# Altium project Time4CM4_PCIeCarrier.PrjPcb (part 1 of 2)
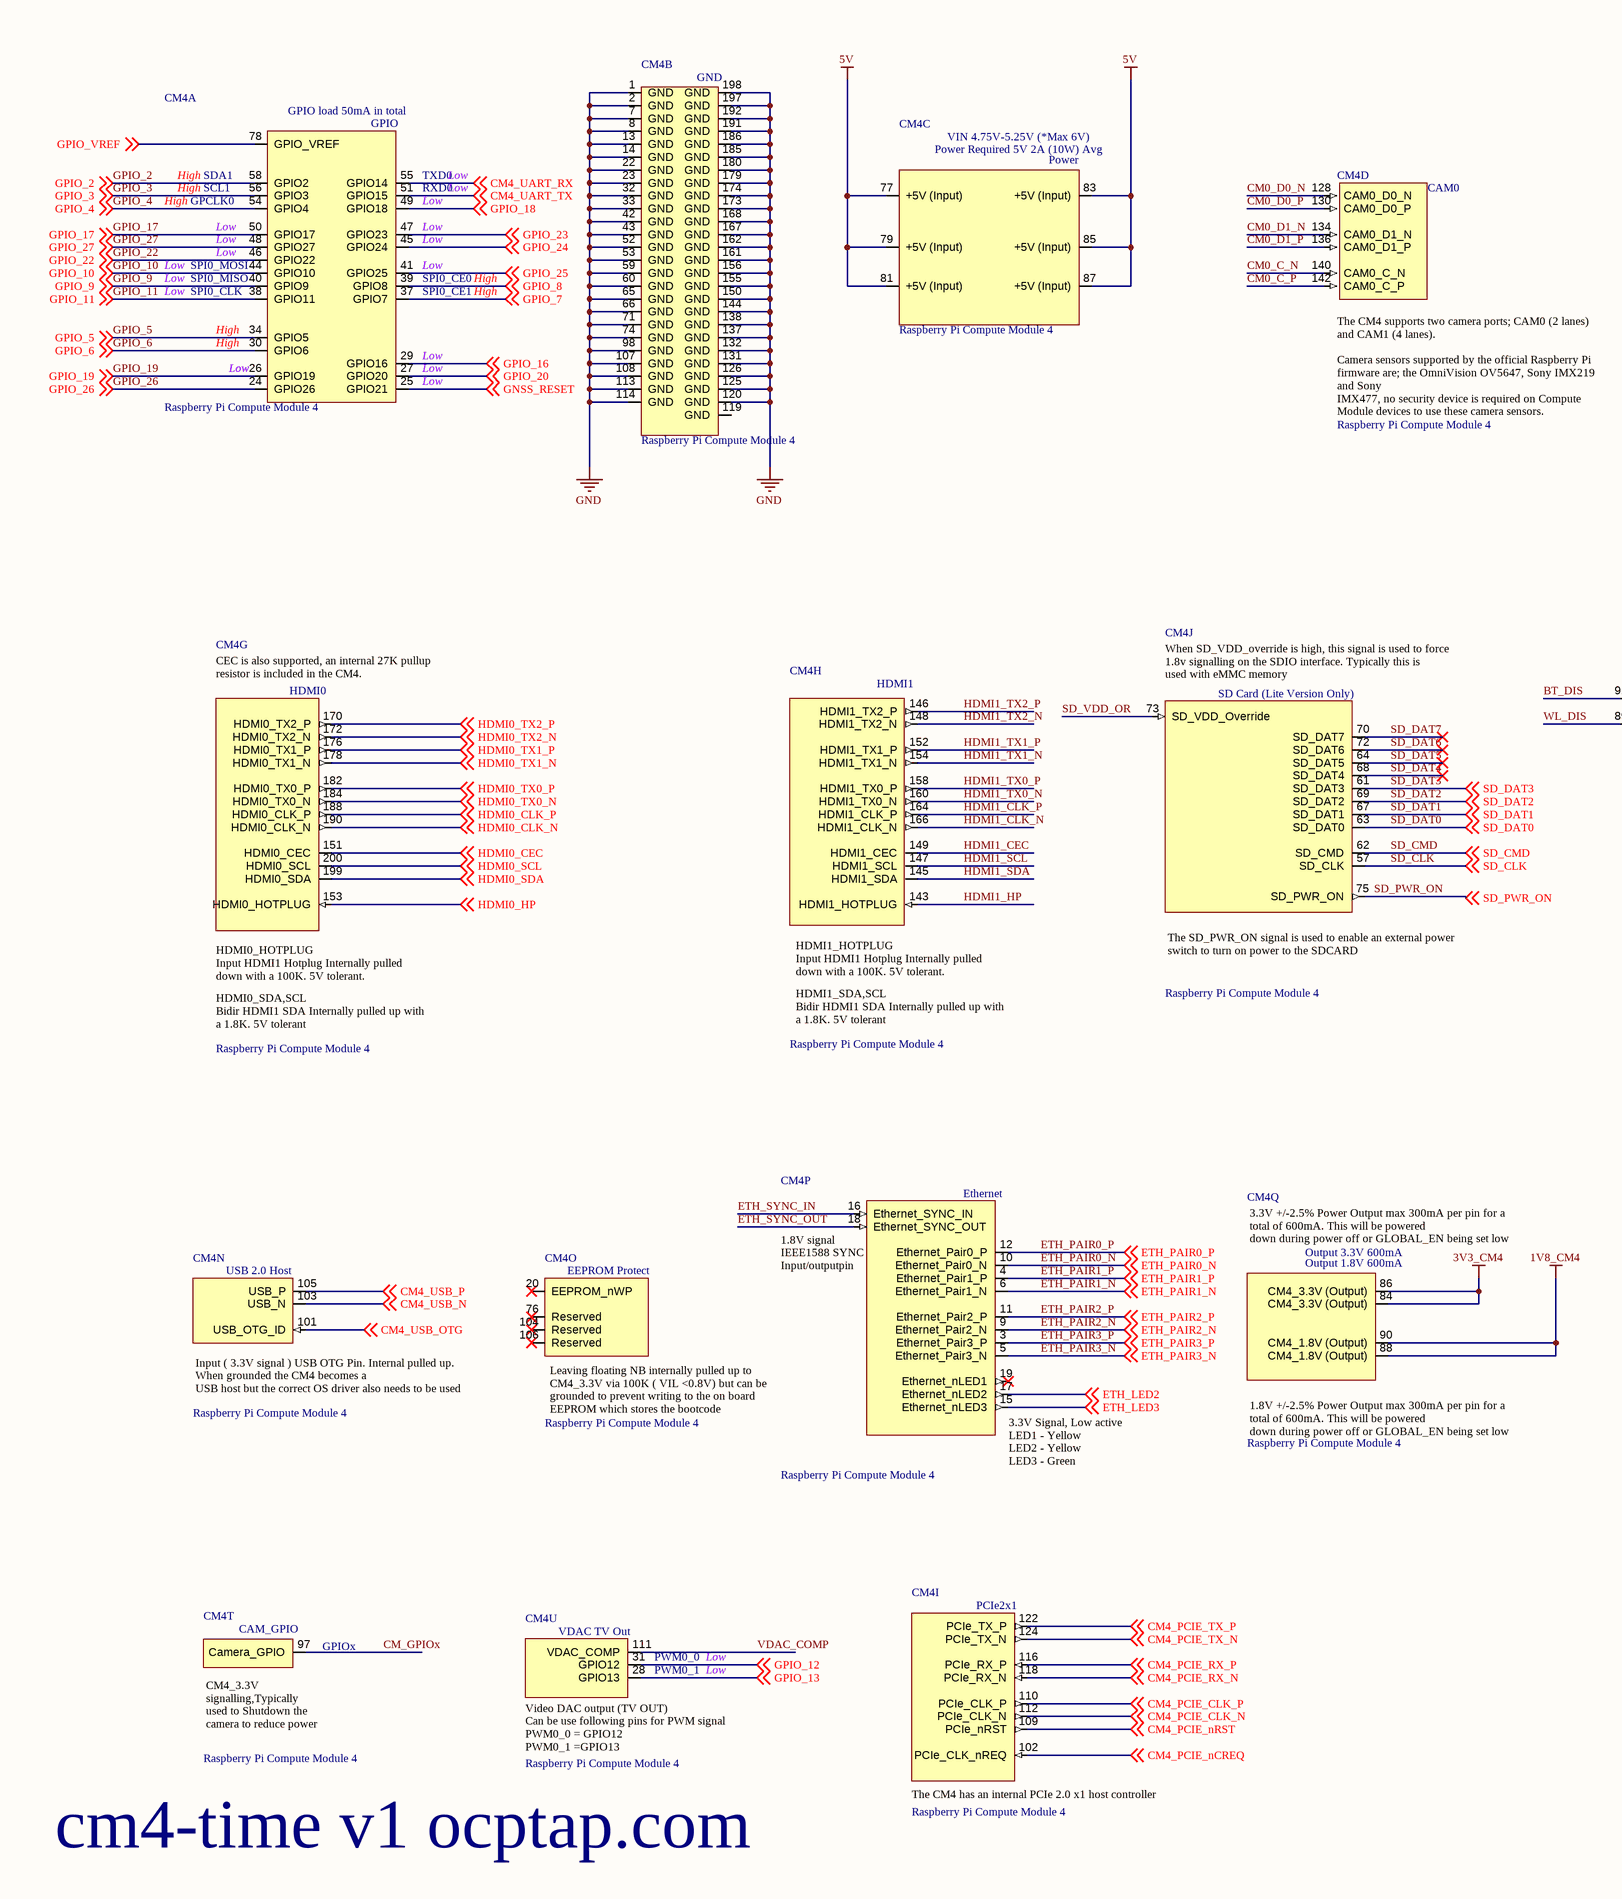
[diagram p0: CM4_Conn.SchDoc, left]
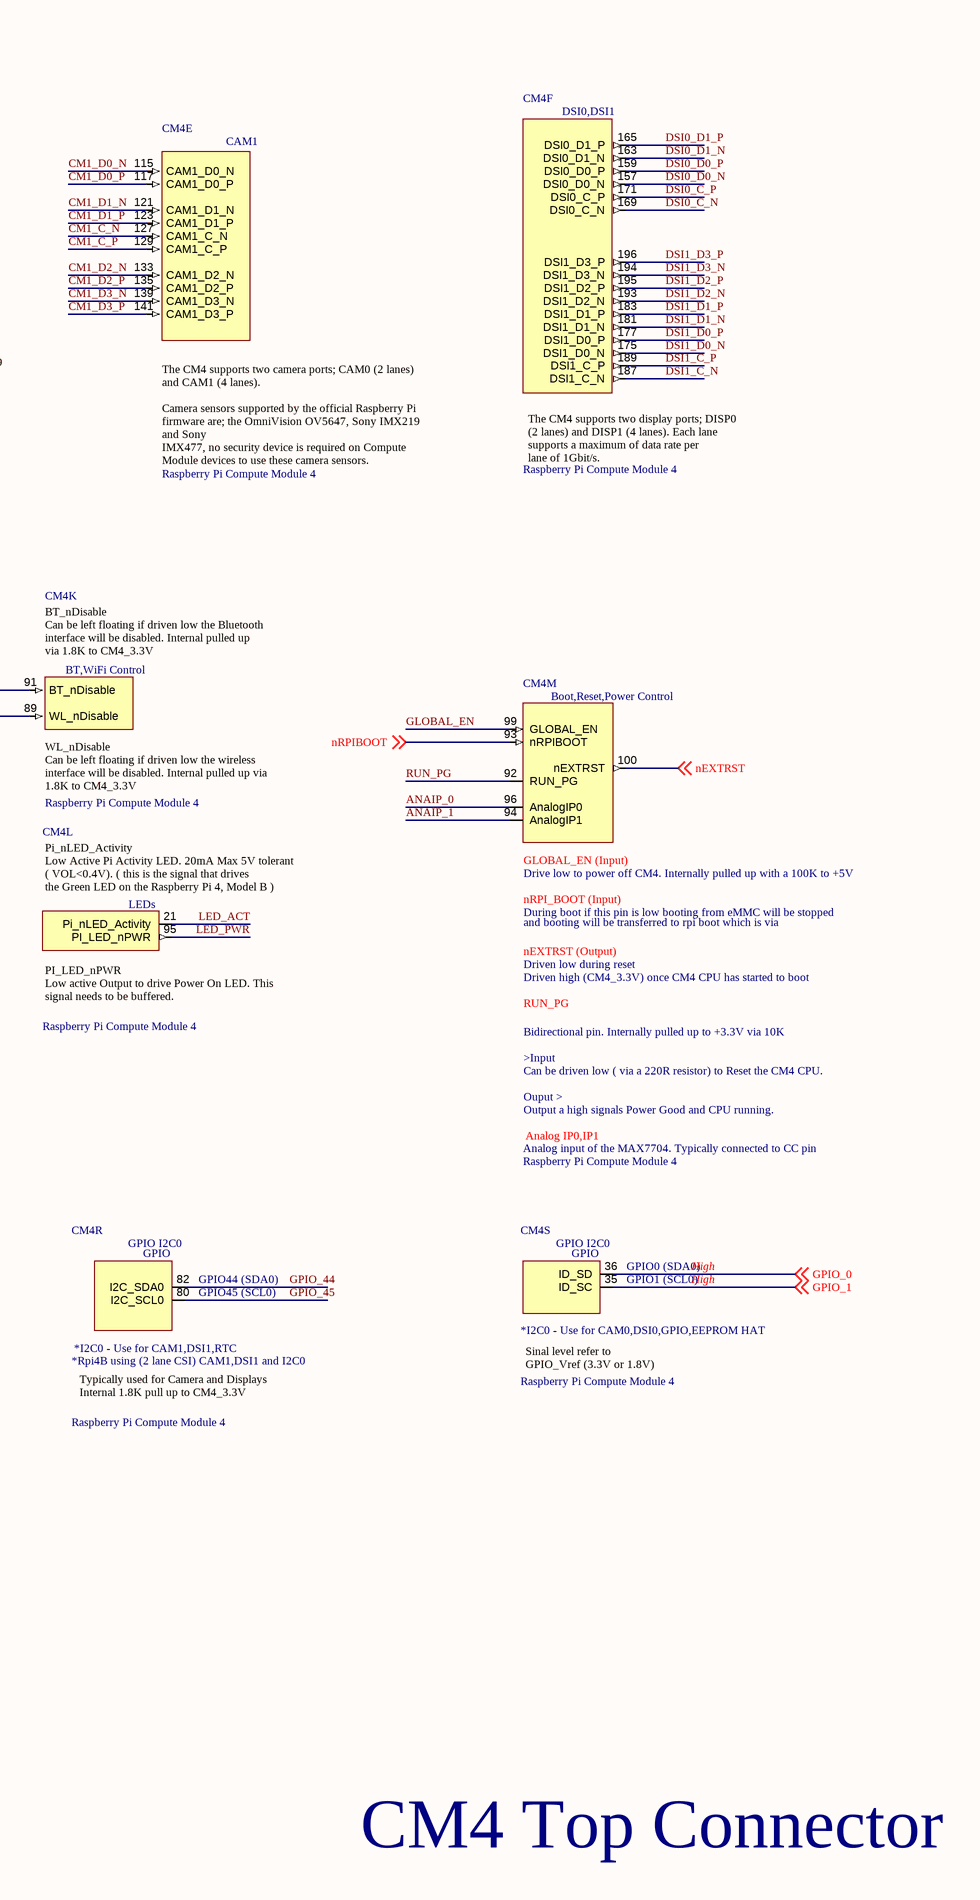
[diagram p1: CM4_Conn.SchDoc, right]
13 sheets, 189 parts. Net scope: flat (ports and power ports of the same name join across sheets).
Board file: Time4CM4_PCIeCarrier_PCB.PcbDoc
Sheets:
  CM4_Conn.SchDoc
  CM4_HDMI.SchDoc
  PCIe_UART_Bridge.SchDoc
  PCIe_Connector.SchDoc
  Power.SchDoc
  External_Connectors.SchDoc
  Dip_Switch.SchDoc
  40_Pin_Connector.SchDoc
  PCIe_USB30.SchDoc
  PCIe_USB30_Power.SchDoc
  PCIe_USB30_Conn_Panel_Top.SchDoc
  PCIe_USB30_Conn_Panel_Bottom.SchDoc
  PCIe_USB30_Conn_Internal_Vertical.SchDoc

## Sheet CM4_Conn.SchDoc
size C; SheetNumber: 1; SheetTotal: 12

### Parts
CM4  Raspberry Pi Compute Module 4  [CM4-F40C-100DS-0.4v_1.5mm_0mm]  (parts A,B,C,D,E,F,G,H,I,J,K,L,M,N,O,P,Q,R,S,T,U of 21)  (no BOM)

### Nets
1V8_CM4: CM4.88(CM4_1.8V_(Output)) CM4.90(CM4_1.8V_(Output))
3V3_CM4: CM4.84(CM4_3.3V_(Output)) CM4.86(CM4_3.3V_(Output))
5V: CM4.77(+5V_(Input)) CM4.79(+5V_(Input)) CM4.81(+5V_(Input)) CM4.83(+5V_(Input)) CM4.85(+5V_(Input)) CM4.87(+5V_(Input))
GND: CM4.1(GND) CM4.2(GND) CM4.7(GND) CM4.8(GND) CM4.13(GND) CM4.14(GND) CM4.22(GND) CM4.23(GND) CM4.32(GND) CM4.33(GND) CM4.42(GND) CM4.43(GND) CM4.52(GND) CM4.53(GND) CM4.59(GND) CM4.60(GND) CM4.65(GND) CM4.66(GND) CM4.71(GND) CM4.74(GND) CM4.98(GND) CM4.107(GND) CM4.108(GND) CM4.113(GND) CM4.114(GND) CM4.120(GND) CM4.125(GND) CM4.126(GND) CM4.131(GND) CM4.132(GND) CM4.137(GND) CM4.138(GND) CM4.144(GND) CM4.150(GND) CM4.155(GND) CM4.156(GND) CM4.161(GND) CM4.162(GND) CM4.167(GND) CM4.168(GND) CM4.173(GND) CM4.174(GND) CM4.179(GND) CM4.180(GND) CM4.185(GND) CM4.186(GND) CM4.191(GND) CM4.192(GND) CM4.197(GND) CM4.198(GND)
ANAIP_0: CM4.96(AnalogIP0)
ANAIP_1: CM4.94(AnalogIP1)
BT_DIS: CM4.91(BT_nDisable)
CM0_C_N: CM4.140(CAM0_C_N)
CM0_C_P: CM4.142(CAM0_C_P)
CM0_D0_N: CM4.128(CAM0_D0_N)
CM0_D0_P: CM4.130(CAM0_D0_P)
CM0_D1_N: CM4.134(CAM0_D1_N)
CM0_D1_P: CM4.136(CAM0_D1_P)
CM1_C_N: CM4.127(CAM1_C_N)
CM1_C_P: CM4.129(CAM1_C_P)
CM1_D0_N: CM4.115(CAM1_D0_N)
CM1_D0_P: CM4.117(CAM1_D0_P)
CM1_D1_N: CM4.121(CAM1_D1_N)
CM1_D1_P: CM4.123(CAM1_D1_P)
CM1_D2_N: CM4.133(CAM1_D2_N)
CM1_D2_P: CM4.135(CAM1_D2_P)
CM1_D3_N: CM4.139(CAM1_D3_N)
CM1_D3_P: CM4.141(CAM1_D3_P)
CM4_PCIE_CLK_N: CM4.112(PCIe_CLK_N) ; off-sheet CM4_PCIE_CLK_N
CM4_PCIE_CLK_P: CM4.110(PCIe_CLK_P) ; off-sheet CM4_PCIE_CLK_P
CM4_PCIE_nCREQ: CM4.102(PCIe_CLK_nREQ) ; off-sheet CM4_PCIE_nCREQ
CM4_PCIE_nRST: CM4.109(PCIe_nRST) ; off-sheet CM4_PCIE_nRST
CM4_PCIE_RX_N: CM4.118(PCIe_RX_N) ; off-sheet CM4_PCIE_RX_N
CM4_PCIE_RX_P: CM4.116(PCIe_RX_P) ; off-sheet CM4_PCIE_RX_P
CM4_PCIE_TX_N: CM4.124(PCIe_TX_N) ; off-sheet CM4_PCIE_TX_N
CM4_PCIE_TX_P: CM4.122(PCIe_TX_P) ; off-sheet CM4_PCIE_TX_P
CM4_UART_RX: CM4.55(GPIO14) ; off-sheet CM4_UART_RX
CM4_UART_TX: CM4.51(GPIO15) ; off-sheet CM4_UART_TX
CM4_USB_N: CM4.103(USB_N) ; off-sheet CM4_USB_N
CM4_USB_OTG: CM4.101(USB_OTG_ID) ; off-sheet CM4_USB_OTG
CM4_USB_P: CM4.105(USB_P) ; off-sheet CM4_USB_P
CM_GPIOx: CM4.97(Camera_GPIO)
DSI0_C_N: CM4.169(DSI0_C_N)
DSI0_C_P: CM4.171(DSI0_C_P)
DSI0_D0_N: CM4.157(DSI0_D0_N)
DSI0_D0_P: CM4.159(DSI0_D0_P)
DSI0_D1_N: CM4.163(DSI0_D1_N)
DSI0_D1_P: CM4.165(DSI0_D1_P)
DSI1_C_N: CM4.187(DSI1_C_N)
DSI1_C_P: CM4.189(DSI1_C_P)
DSI1_D0_N: CM4.175(DSI1_D0_N)
DSI1_D0_P: CM4.177(DSI1_D0_P)
DSI1_D1_N: CM4.181(DSI1_D1_N)
DSI1_D1_P: CM4.183(DSI1_D1_P)
DSI1_D2_N: CM4.193(DSI1_D2_N)
DSI1_D2_P: CM4.195(DSI1_D2_P)
DSI1_D3_N: CM4.194(DSI1_D3_N)
DSI1_D3_P: CM4.196(DSI1_D3_P)
ETH_LED2: CM4.17(Ethernet_nLED2) ; off-sheet ETH_LED2
ETH_LED3: CM4.15(Ethernet_nLED3) ; off-sheet ETH_LED3
ETH_PAIR0_N: CM4.10(Ethernet_Pair0_N) ; off-sheet ETH_PAIR0_N
ETH_PAIR0_P: CM4.12(Ethernet_Pair0_P) ; off-sheet ETH_PAIR0_P
ETH_PAIR1_N: CM4.6(Ethernet_Pair1_N) ; off-sheet ETH_PAIR1_N
ETH_PAIR1_P: CM4.4(Ethernet_Pair1_P) ; off-sheet ETH_PAIR1_P
ETH_PAIR2_N: CM4.9(Ethernet_Pair2_N) ; off-sheet ETH_PAIR2_N
ETH_PAIR2_P: CM4.11(Ethernet_Pair2_P) ; off-sheet ETH_PAIR2_P
ETH_PAIR3_N: CM4.5(Ethernet_Pair3_N) ; off-sheet ETH_PAIR3_N
ETH_PAIR3_P: CM4.3(Ethernet_Pair3_P) ; off-sheet ETH_PAIR3_P
ETH_SYNC_IN: CM4.16(Ethernet_SYNC_IN)
ETH_SYNC_OUT: CM4.18(Ethernet_SYNC_OUT)
GLOBAL_EN: CM4.99(GLOBAL_EN)
GNSS_RESET: CM4.25(GPIO21) ; off-sheet GNSS_RESET
GPIO_0: CM4.36(ID_SD) ; off-sheet GPIO_0
GPIO_1: CM4.35(ID_SC) ; off-sheet GPIO_1
GPIO_2: CM4.58(GPIO2) ; off-sheet GPIO_2
GPIO_3: CM4.56(GPIO3) ; off-sheet GPIO_3
GPIO_4: CM4.54(GPIO4) ; off-sheet GPIO_4
GPIO_5: CM4.34(GPIO5) ; off-sheet GPIO_5
GPIO_6: CM4.30(GPIO6) ; off-sheet GPIO_6
GPIO_7: CM4.37(GPIO7) ; off-sheet GPIO_7
GPIO_8: CM4.39(GPIO8) ; off-sheet GPIO_8
GPIO_9: CM4.40(GPIO9) ; off-sheet GPIO_9
GPIO_10: CM4.44(GPIO10) ; off-sheet GPIO_10
GPIO_11: CM4.38(GPIO11) ; off-sheet GPIO_11
GPIO_12: CM4.31(GPIO12) ; off-sheet GPIO_12
GPIO_13: CM4.28(GPIO13) ; off-sheet GPIO_13
GPIO_16: CM4.29(GPIO16) ; off-sheet GPIO_16
GPIO_17: CM4.50(GPIO17) ; off-sheet GPIO_17
GPIO_18: CM4.49(GPIO18) ; off-sheet GPIO_18
GPIO_19: CM4.26(GPIO19) ; off-sheet GPIO_19
GPIO_20: CM4.27(GPIO20) ; off-sheet GPIO_20
GPIO_22: CM4.46(GPIO22) ; off-sheet GPIO_22
GPIO_23: CM4.47(GPIO23) ; off-sheet GPIO_23
GPIO_24: CM4.45(GPIO24) ; off-sheet GPIO_24
GPIO_25: CM4.41(GPIO25) ; off-sheet GPIO_25
GPIO_26: CM4.24(GPIO26) ; off-sheet GPIO_26
GPIO_27: CM4.48(GPIO27) ; off-sheet GPIO_27
GPIO_44: CM4.82(I2C_SDA0)
GPIO_45: CM4.80(I2C_SCL0)
GPIO_VREF: CM4.78(GPIO_VREF) ; off-sheet GPIO_VREF
HDMI0_CEC: CM4.151(HDMI0_CEC) ; off-sheet HDMI0_CEC
HDMI0_CLK_N: CM4.190(HDMI0_CLK_N) ; off-sheet HDMI0_CLK_N
HDMI0_CLK_P: CM4.188(HDMI0_CLK_P) ; off-sheet HDMI0_CLK_P
HDMI0_HP: CM4.153(HDMI0_HOTPLUG) ; off-sheet HDMI0_HP
HDMI0_SCL: CM4.200(HDMI0_SCL) ; off-sheet HDMI0_SCL
HDMI0_SDA: CM4.199(HDMI0_SDA) ; off-sheet HDMI0_SDA
HDMI0_TX0_N: CM4.184(HDMI0_TX0_N) ; off-sheet HDMI0_TX0_N
HDMI0_TX0_P: CM4.182(HDMI0_TX0_P) ; off-sheet HDMI0_TX0_P
HDMI0_TX1_N: CM4.178(HDMI0_TX1_N) ; off-sheet HDMI0_TX1_N
HDMI0_TX1_P: CM4.176(HDMI0_TX1_P) ; off-sheet HDMI0_TX1_P
HDMI0_TX2_N: CM4.172(HDMI0_TX2_N) ; off-sheet HDMI0_TX2_N
HDMI0_TX2_P: CM4.170(HDMI0_TX2_P) ; off-sheet HDMI0_TX2_P
HDMI1_CEC: CM4.149(HDMI1_CEC)
HDMI1_CLK_N: CM4.166(HDMI1_CLK_N)
HDMI1_CLK_P: CM4.164(HDMI1_CLK_P)
HDMI1_HP: CM4.143(HDMI1_HOTPLUG)
HDMI1_SCL: CM4.147(HDMI1_SCL)
HDMI1_SDA: CM4.145(HDMI1_SDA)
HDMI1_TX0_N: CM4.160(HDMI1_TX0_N)
HDMI1_TX0_P: CM4.158(HDMI1_TX0_P)
HDMI1_TX1_N: CM4.154(HDMI1_TX1_N)
HDMI1_TX1_P: CM4.152(HDMI1_TX1_P)
HDMI1_TX2_N: CM4.148(HDMI1_TX2_N)
HDMI1_TX2_P: CM4.146(HDMI1_TX2_P)
LED_ACT: CM4.21(Pi_nLED_Activity)
LED_PWR: CM4.95(PI_LED_nPWR)
nEXTRST: CM4.100(nEXTRST) ; off-sheet nEXTRST
nRPIBOOT: CM4.93(nRPIBOOT) ; off-sheet nRPIBOOT
RUN_PG: CM4.92(RUN_PG)
SD_CLK: CM4.57(SD_CLK) ; off-sheet SD_CLK
SD_CMD: CM4.62(SD_CMD) ; off-sheet SD_CMD
SD_DAT0: CM4.63(SD_DAT0) ; off-sheet SD_DAT0
SD_DAT1: CM4.67(SD_DAT1) ; off-sheet SD_DAT1
SD_DAT2: CM4.69(SD_DAT2) ; off-sheet SD_DAT2
SD_DAT3: CM4.61(SD_DAT3) ; off-sheet SD_DAT3
SD_DAT4: CM4.68(SD_DAT4)
SD_DAT5: CM4.64(SD_DAT5)
SD_DAT6: CM4.72(SD_DAT6)
SD_DAT7: CM4.70(SD_DAT7)
SD_PWR_ON: CM4.75(SD_PWR_ON) ; off-sheet SD_PWR_ON
SD_VDD_OR: CM4.73(SD_VDD_Override)
VDAC_COMP: CM4.111(VDAC_COMP)
WL_DIS: CM4.89(WL_nDisable)

Not connected (* = marked no-connect by the designer): CM4 19(Ethernet_nLED1)* 20(EEPROM_nWP)* 76(Reserved)* 104(Reserved)* 106(Reserved)* 119(GND)

### Notes on the sheet
- cm4-time v1 ocptap.com
- CM4 Top Connector
- DWG. NO.
- REV.
- SHT.
- REVISION
- DESCRIPTION
- DATE
- APPROVED
- THIS DOCUMENT AND THE DATA DISCLOSED HEREIN OR HEREWITH IS THE PROPERTY OF ALTIUM LIMITED AND MAY BE FREELY DISTRIBUTED IN WHOLE. NO RIGHTS ARE RESERVED OR EXPRESS OR IMPLIED WARANTEE GIVEN.
- ENG:
- DSN:
- APPROVALS
- PROJECT
- DOCUMENT REVISION:
- DESIGN ITEM:
- CHK:
- BOM:
- REFERENCE DOCUMENTS
- PROJECT REVISION:
- TITLE
- FAB DWG:
- PCB DWG:
- ASSY DWG:
- SCALE:
- SIZE
- C
- CAGE CODE
- FILE NAME
- DWG NO.
- SHEET
- OF
- REV
- (in symbol CM4, part A) GPIO load 50mA in total; GPIO; High; SDA1; TXD0; Low; SCL1; RXD0; GPCLK0; SPI0_MOSI; SPI0_MISO; SPI0_CE0; SPI0_CLK; SPI0_CE1; by Amornthep Phunsin
- (in symbol CM4, part C) VIN 4.75V-5.25V (*Max 6V); Power Required 5V 2A (10W) Avg; Power; by Amornthep Phunsin
- (in symbol CM4, part D) CAM0; The CM4 supports two camera ports; CAM0 (2 lanes) and CAM1 (4 lanes). / Camera sensors supported by the official Raspberry Pi firmware are; the OmniVision OV5647, Sony IMX219 and Sony / IMX477, no security device is required on Compute Module devices to use these camera sensors.
- (in symbol CM4, part E) CAM1; The CM4 supports two camera ports; CAM0 (2 lanes) and CAM1 (4 lanes). / Camera sensors supported by the official Raspberry Pi firmware are; the OmniVision OV5647, Sony IMX219 and Sony / IMX477, no security device is required on Compute Module devices to use these camera sensors.
- (in symbol CM4, part F) DSI0,DSI1; The CM4 supports two display ports; DISP0 (2 lanes) and DISP1 (4 lanes). Each lane supports a maximum of data rate per / lane of 1Gbit/s.
- (in symbol CM4, part G) HDMI0; CEC is also supported, an internal 27K pullup resistor is included in the CM4.; HDMI0_HOTPLUG / Input HDMI1 Hotplug Internally pulled down with a 100K. 5V tolerant.; HDMI0_SDA,SCL / Bidir HDMI1 SDA Internally pulled up with a 1.8K. 5V tolerant
- (in symbol CM4, part H) HDMI1; HDMI1_HOTPLUG / Input HDMI1 Hotplug Internally pulled down with a 100K. 5V tolerant.; HDMI1_SDA,SCL / Bidir HDMI1 SDA Internally pulled up with a 1.8K. 5V tolerant
- (in symbol CM4, part I) PCIe2x1; The CM4 has an internal PCIe 2.0 x1 host controller
- (in symbol CM4, part J) When SD_VDD_override is high, this signal is used to force 1.8v signalling on the SDIO interface. Typically this is / used with eMMC memory; SD Card (Lite Version Only); by Amornthep Phunsin; The SD_PWR_ON signal is used to enable an external power switch to turn on power to the SDCARD
- (in symbol CM4, part K) BT_nDisable / Can be left floating if driven low the Bluetooth interface will be disabled. Internal pulled up / via 1.8K to CM4_3.3V; BT,WiFi Control; WL_nDisable / Can be left floating if driven low the wireless interface will be disabled. Internal pulled up via / 1.8K to CM4_3.3V
- (in symbol CM4, part L) Pi_nLED_Activity / Low Active Pi Activity LED. 20mA Max 5V tolerant ( VOL<0.4V). ( this is the signal that drives / the Green LED on the Raspberry Pi 4, Model B ); LEDs; PI_LED_nPWR / Low active Output to drive Power On LED. This signal needs to be buffered.
- (in symbol CM4, part M) Boot,Reset,Power Control; GLOBAL_EN (Input); Drive low to power off CM4. Internally pulled up with a 100K to +5V; nRPI_BOOT (Input); During boot if this pin is low booting from eMMC will be stopped; and booting will be transferred to rpi boot which is via; nEXTRST (Output); Driven low during reset; Driven high (CM4_3.3V) once CM4 CPU has started to boot; Bidirectional pin. Internally pulled up to +3.3V via 10K / >Input / Can be driven low ( via a 220R resistor) to Reset the CM4 CPU. / Ouput > / Output a high signals Power Good and CPU running.; Analog IP0,IP1; Analog input of the MAX7704. Typically connected to CC pin
- (in symbol CM4, part N) USB 2.0 Host; Input ( 3.3V signal ) USB OTG Pin. Internal pulled up. When grounded the CM4 becomes a / USB host but the correct OS driver also needs to be used
- (in symbol CM4, part O) EEPROM Protect; Leaving floating NB internally pulled up to CM4_3.3V via 100K ( VIL <0.8V) but can be / grounded to prevent writing to the on board EEPROM which stores the bootcode
- (in symbol CM4, part P) Ethernet; 1.8V signal / IEEE1588 SYNC Input/outputpin; by Amornthep Phunsin; 3.3V Signal, Low active / LED1 - Yellow / LED2 - Yellow / LED3 - Green
- (in symbol CM4, part Q) 3.3V +/-2.5% Power Output max 300mA per pin for a total of 600mA. This will be powered / down during power off or GLOBAL_EN being set low; Output 3.3V 600mA; Output 1.8V 600mA; 1.8V +/-2.5% Power Output max 300mA per pin for a total of 600mA. This will be powered / down during power off or GLOBAL_EN being set low
- (in symbol CM4, part R) GPIO I2C0; GPIO; GPIO44 (SDA0); GPIO45 (SCL0); *I2C0 - Use for CAM1,DSI1,RTC; *Rpi4B using (2 lane CSI) CAM1,DSI1 and I2C0; Typically used for Camera and Displays Internal 1.8K pull up to CM4_3.3V
- (in symbol CM4, part S) GPIO I2C0; GPIO; GPIO0 (SDA0); High; GPIO1 (SCL0); *I2C0 - Use for CAM0,DSI0,GPIO,EEPROM HAT; Sinal level refer to  GPIO_Vref (3.3V or 1.8V)
- (in symbol CM4, part T) CAM_GPIO; GPIOx; CM4_3.3V signalling,Typically used to Shutdown the camera to reduce power
- (in symbol CM4, part U) VDAC TV Out; PWM0_0; Low; PWM0_1; Video DAC output (TV OUT) / Can be use following pins for PWM signal / PWM0_0 = GPIO12 / PWM0_1 =GPIO13

### Library data of the parts
CM4 = CM4: Raspberry Pi Compute Module 4 by Amornthep Phunsin

## Sheet CM4_HDMI.SchDoc
size A4; SheetNumber: 2; SheetTotal: 12
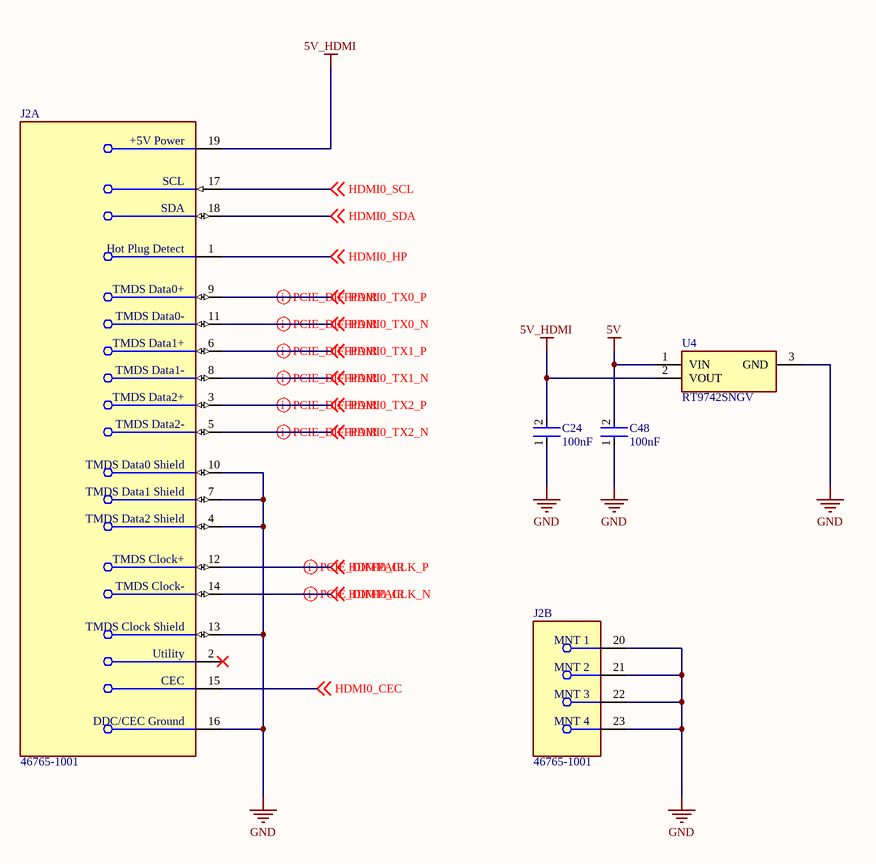
[diagram p2: CM4_HDMI.SchDoc]

### Parts
C24  100nF  [FP-GRM15-MFG]
C48  100nF  [FP-GRM15-MFG]
J2  46765-1001  [FP-46765-1001-MFG]  (parts A,B of 2)
U4  RT9742SNGV  [SOT95P279X130-3N]

### Nets
5V: C48.2 U4.1(VIN)
5V_HDMI: C24.2 J2.19(+5V_Power) U4.2(VOUT)
GND: C24.1 C48.1 J2.4(TMDS_Data2_Shield) J2.7(TMDS_Data1_Shield) J2.10(TMDS_Data0_Shield) J2.13(TMDS_Clock_Shield) J2.16(DDC/CEC_Ground) J2.20(MNT_1) J2.21(MNT_2) J2.22(MNT_3) J2.23(MNT_4) U4.3(GND)
HDMI0_CEC: J2.15(CEC) ; off-sheet HDMI0_CEC
HDMI0_CLK_N: J2.14(TMDS_Clock-) ; off-sheet HDMI0_CLK_N
HDMI0_CLK_P: J2.12(TMDS_Clock+) ; off-sheet HDMI0_CLK_P
HDMI0_HP: J2.1(Hot_Plug_Detect) ; off-sheet HDMI0_HP
HDMI0_SCL: J2.17(SCL) ; off-sheet HDMI0_SCL
HDMI0_SDA: J2.18(SDA) ; off-sheet HDMI0_SDA
HDMI0_TX0_N: J2.11(TMDS_Data0-) ; off-sheet HDMI0_TX0_N
HDMI0_TX0_P: J2.9(TMDS_Data0+) ; off-sheet HDMI0_TX0_P
HDMI0_TX1_N: J2.8(TMDS_Data1-) ; off-sheet HDMI0_TX1_N
HDMI0_TX1_P: J2.6(TMDS_Data1+) ; off-sheet HDMI0_TX1_P
HDMI0_TX2_N: J2.5(TMDS_Data2-) ; off-sheet HDMI0_TX2_N
HDMI0_TX2_P: J2.3(TMDS_Data2+) ; off-sheet HDMI0_TX2_P

Not connected (* = marked no-connect by the designer): J2 2(Utility)*

### Layout directives
differential pair; differential pair class HDMI: HDMI0_CLK_N, HDMI0_CLK_P, HDMI0_TX0_N, HDMI0_TX0_P, HDMI0_TX1_N, HDMI0_TX1_P, HDMI0_TX2_N, HDMI0_TX2_P

### Library data of the parts
C24 C48 = CMP-2100-03641-2: CAP CER 0.1UF 16V X7R 0402; Manufacturer Part Number: GRM155R71C104KA88D; Manufacturer: Murata; Standoff Height: 0mm; Tolerance: 10%; Voltage Rating: 16Vdc; Material: Ceramic; Capacitance: 0.10μF; Value: 0.10μF; RoHS: TRUE; Temperature Characteristic: X7R; Octopart: https://octopart.com/grm155r71c104ka88d-murata-196880; Digikey Description: CAP CER 0.1UF 16V X7R 0402; Device Class L3: Ceramic Capacitors; Height: 0.55mm; ComponentLink2Description: Datasheet; Temperature Range Low: -55°C; Ipc Land Pattern Name: CAPC10050X219; ComponentLink2URL: https://search.murata.co.jp/Ceramy/image/img/A01X/G101/ENG/GRM155R71H471KA01-01A.pdf; Device Class L1: Passive Components; Lead Free: yes; Category: Cap; Package: GRM15; Temperature: -55°C to +125°C; Device Class L2: Capacitors; Temperature Range High: +125°C; Mouser Description: 0402 0.1 uF 16V ±10 % Tolerance X7R SMT Multilayer Ceramic Capacitor
J2 = CMP-04768-000007-1: CONN RCP MICRO HDMI 19POS SMD RA; Voltage Rating: 30V; Pitch: 0.4mm; Number of Terminals/Pins: 19; Number of Ports: 1; Current Rating: 800mA; Gender: Receptacle; Body Material: Plastic; Min Operating Temperature: -30°C; Series: 46765; Contact Material: Copper Alloy; Contact Plating: Gold; Connector Type: HDMI; Mount: Surface Mount; Termination: Solder; Package Quantity: 1000; Flammability Rating: UL94 V-0; Packaging: Tape and Reel; Length: 6.5mm; Number of Positions: 19; Number of Contacts: 19; Weight: 0.0109oz; Max Current Rating: 800mA; Case/Package: Metal; Housing Material: Polymer; RoHS Compliant: Yes; Max Operating Temperature: 85°C; Orientation: Right Angle; Depth: 7.5mm; Width: 7mm
U4 = RT9742SNGV: Integrated Circuit; Manufacturer_Name: RICHTEK; Datasheet Link: https://datasheet.lcsc.com/szlcsc/Richtek-Tech-RT9742ANGJ5F_C147955.pdf; Height: 1.295mm; Manufacturer_Part_Number: RT9742SNGV

## Sheet PCIe_UART_Bridge.SchDoc
size A; SheetNumber: 3; SheetTotal: 12
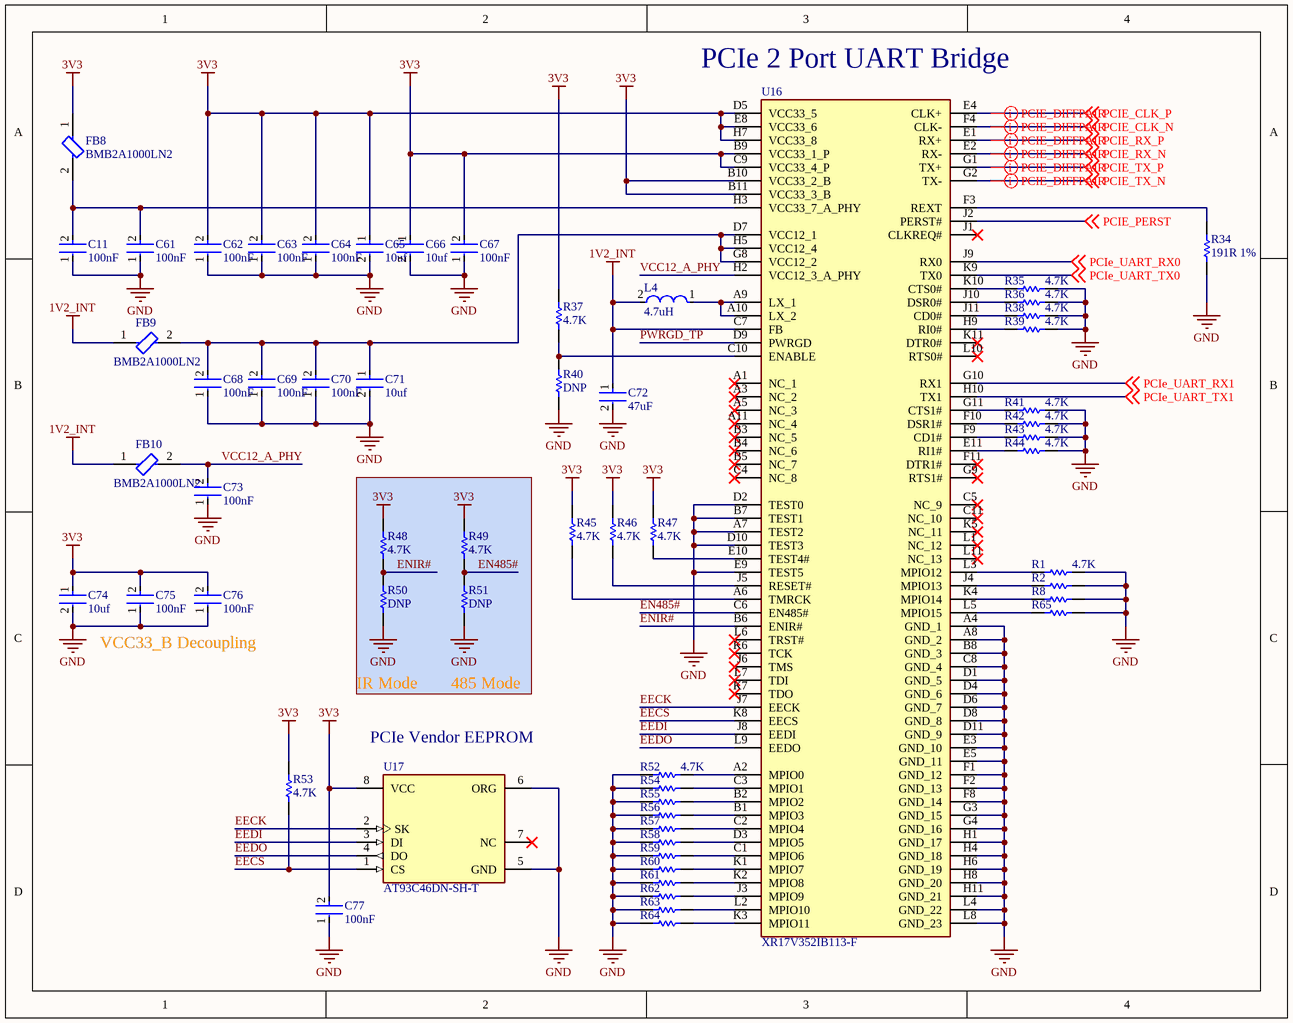
[diagram p3: PCIe_UART_Bridge.SchDoc]

### Parts
C11  100nF  [FP-GRM15-MFG]
C61  100nF  [FP-GRM15-MFG]
C62  100nF  [FP-GRM15-MFG]
C63  100nF  [FP-GRM15-MFG]
C64  100nF  [FP-GRM15-MFG]
C65  10uf  [FP-GRM188-0_2-IPC_C]
C66  10uf  [FP-GRM188-0_2-IPC_C]
C67  100nF  [FP-GRM15-MFG]
C68  100nF  [FP-GRM15-MFG]
C69  100nF  [FP-GRM15-MFG]
C70  100nF  [FP-GRM15-MFG]
C71  10uf  [FP-GRM188-0_2-IPC_C]
C72  47uF  [FP-C2012-125-0_2-IPC_B]
C73  100nF  [FP-GRM15-MFG]
C74  10uf  [FP-GRM188-0_2-IPC_C]
C75  100nF  [FP-GRM15-MFG]
C76  100nF  [FP-GRM15-MFG]
C77  100nF  [FP-GRM15-MFG]
FB8  BMB2A1000LN2  [FP-BMB2A1000LN2-IPC_C]
FB9  BMB2A1000LN2  [FP-BMB2A1000LN2-IPC_C]
FB10  BMB2A1000LN2  [FP-BMB2A1000LN2-IPC_C]
L4  4.7uH  [FP-NR3012-MFG]
R1  4.7K  [RESC1005X40X25LL05T05]
R2  4.7K  [RESC1005X40X25LL05T05]  (value not drawn)
R8  4.7K  [RESC1005X40X25LL05T05]  (value not drawn)
R34  191R 1%  [RESC1005X40X25ML05T05]
R35  4.7K  [RESC1005X40X25LL05T05]
R36  4.7K  [RESC1005X40X25LL05T05]
R37  4.7K  [RESC1005X40X25LL05T05]
R38  4.7K  [RESC1005X40X25LL05T05]
R39  4.7K  [RESC1005X40X25LL05T05]
R40  DNP  [RESC1005X40X25LL05T05]
R41  4.7K  [RESC1005X40X25LL05T05]
R42  4.7K  [RESC1005X40X25LL05T05]
R43  4.7K  [RESC1005X40X25LL05T05]
R44  4.7K  [RESC1005X40X25LL05T05]
R45  4.7K  [RESC1005X40X25LL05T05]
R46  4.7K  [RESC1005X40X25LL05T05]
R47  4.7K  [RESC1005X40X25LL05T05]
R48  4.7K  [RESC1005X40X25LL05T05]
R49  4.7K  [RESC1005X40X25LL05T05]
R50  DNP  [RESC1005X40X25LL05T05]
R51  DNP  [RESC1005X40X25LL05T05]
R52  4.7K  [RESC1005X40X25LL05T05]
R53  4.7K  [RESC1005X40X25LL05T05]
R54  4.7K  [RESC1005X40X25LL05T05]  (value not drawn)
R55  4.7K  [RESC1005X40X25LL05T05]  (value not drawn)
R56  4.7K  [RESC1005X40X25LL05T05]  (value not drawn)
R57  4.7K  [RESC1005X40X25LL05T05]  (value not drawn)
R58  4.7K  [RESC1005X40X25LL05T05]  (value not drawn)
R59  4.7K  [RESC1005X40X25LL05T05]  (value not drawn)
R60  4.7K  [RESC1005X40X25LL05T05]  (value not drawn)
R61  4.7K  [RESC1005X40X25LL05T05]  (value not drawn)
R62  4.7K  [RESC1005X40X25LL05T05]  (value not drawn)
R63  4.7K  [RESC1005X40X25LL05T05]  (value not drawn)
R64  4.7K  [RESC1005X40X25LL05T05]  (value not drawn)
R65  4.7K  [RESC1005X40X25LL05T05]  (value not drawn)
U16  XR17V352IB113-F  [BGA113C80P11X11_900X900X153]
U17  AT93C46DN-SH-T  [FP-C04-057-SN-MFG]

### Nets
1V2_INT: C72.1 FB9.1 FB10.1 L4.2 U16.C7(FB)
3V3: C62.2 C63.2 C64.2 C65.1 C66.1 C67.2 C74.1 C75.2 C76.2 C77.2 FB8.1 R37.2 R45.2 R46.2 R47.2 R48.2 R49.2 R53.2 U16.B9(VCC33_1_P) U16.B10(VCC33_2_B) U16.B11(VCC33_3_B) U16.C9(VCC33_4_P) U16.D5(VCC33_5) U16.E8(VCC33_6) U16.H7(VCC33_8) U17.8(VCC)
GND: C11.1 C61.1 C62.1 C63.1 C64.1 C65.2 C66.2 C67.1 C68.1 C69.1 C70.1 C71.2 C72.2 C73.1 C74.2 C75.1 C76.1 C77.1 R1.1 R2.1 R8.1 R34.2 R35.1 R36.1 R38.1 R39.1 R40.1 R41.1 R42.1 R43.1 R44.1 R50.1 R51.1 R52.2 R54.2 R55.2 R56.2 R57.2 R58.2 R59.2 R60.2 R61.2 R62.2 R63.2 R64.2 R65.1 U16.A4(GND_1) U16.A7(TEST2) U16.A8(GND_2) U16.B7(TEST1) U16.B8(GND_3) U16.C8(GND_4) U16.D1(GND_5) U16.D2(TEST0) U16.D4(GND_6) U16.D6(GND_7) U16.D8(GND_8) U16.D10(TEST3) U16.D11(GND_9) U16.E3(GND_10) U16.E5(GND_11) U16.E9(TEST5) U16.F1(GND_12) U16.F2(GND_13) U16.F8(GND_14) U16.G3(GND_15) U16.G4(GND_16) U16.H1(GND_17) U16.H4(GND_18) U16.H6(GND_19) U16.H8(GND_20) U16.H11(GND_21) U16.L4(GND_22) U16.L8(GND_23) U17.5(GND) U17.6(ORG)
EECK: U16.J7(EECK) U17.2(SK)
EECS: R53.1 U16.K8(EECS) U17.1(CS)
EEDI: U16.J8(EEDI) U17.3(DI)
EEDO: U16.L9(EEDO) U17.4(DO)
EN485#: R49.1 R51.2 U16.C6(EN485#)
ENIR#: R48.1 R50.2 U16.B6(ENIR#)
PCIE_CLK_N: U16.F4(CLK-) ; off-sheet PCIE_CLK_N
PCIE_CLK_P: U16.E4(CLK+) ; off-sheet PCIE_CLK_P
PCIE_PERST: U16.J2(PERST#) ; off-sheet PCIE_PERST
PCIE_RX_N: U16.E2(RX-) ; off-sheet PCIE_RX_N
PCIE_RX_P: U16.E1(RX+) ; off-sheet PCIE_RX_P
PCIE_TX_N: U16.G2(TX-) ; off-sheet PCIE_TX_N
PCIE_TX_P: U16.G1(TX+) ; off-sheet PCIE_TX_P
PCIe_UART_RX0: U16.J9(RX0) ; off-sheet PCIe_UART_RX0
PCIe_UART_RX1: U16.G10(RX1) ; off-sheet PCIe_UART_RX1
PCIe_UART_TX0: U16.K9(TX0) ; off-sheet PCIe_UART_TX0
PCIe_UART_TX1: U16.H10(TX1) ; off-sheet PCIe_UART_TX1
PWRGD_TP: U16.D9(PWRGD)
VCC12_A_PHY: C73.2 FB10.2 U16.H2(VCC12_3_A_PHY)
NetC11_2: C11.2 C61.2 FB8.2 U16.H3(VCC33_7_A_PHY)
NetC68_2: C68.2 C69.2 C70.2 C71.1 FB9.2 U16.D7(VCC12_1) U16.G8(VCC12_2) U16.H5(VCC12_4)
NetL4_1: L4.1 U16.A9(LX_1) U16.A10(LX_2)
NetR1_2: R1.2 U16.L3(MPIO12)
NetR2_2: R2.2 U16.J4(MPIO13)
NetR8_2: R8.2 U16.K4(MPIO14)
NetR34_1: R34.1 U16.F3(REXT)
NetR35_2: R35.2 U16.K10(CTS0#)
NetR36_2: R36.2 U16.J10(DSR0#)
NetR37_1: R37.1 R40.2 U16.C10(ENABLE)
NetR38_2: R38.2 U16.J11(CD0#)
NetR39_2: R39.2 U16.H9(RI0#)
NetR41_2: R41.2 U16.G11(CTS1#)
NetR42_2: R42.2 U16.F10(DSR1#)
NetR43_2: R43.2 U16.F9(CD1#)
NetR44_2: R44.2 U16.E11(RI1#)
NetR45_1: R45.1 U16.A6(TMRCK)
NetR46_1: R46.1 U16.J5(RESET#)
NetR47_1: R47.1 U16.E10(TEST4#)
NetR52_1: R52.1 U16.A2(MPIO0)
NetR54_1: R54.1 U16.C3(MPIO1)
NetR55_1: R55.1 U16.B2(MPIO2)
NetR56_1: R56.1 U16.B1(MPIO3)
NetR57_1: R57.1 U16.C2(MPIO4)
NetR58_1: R58.1 U16.D3(MPIO5)
NetR59_1: R59.1 U16.C1(MPIO6)
NetR60_1: R60.1 U16.K1(MPIO7)
NetR61_1: R61.1 U16.K2(MPIO8)
NetR62_1: R62.1 U16.J3(MPIO9)
NetR63_1: R63.1 U16.L2(MPIO10)
NetR64_1: R64.1 U16.K3(MPIO11)
NetR65_2: R65.2 U16.L5(MPIO15)

Not connected (* = marked no-connect by the designer): U16 A1(NC_1)* A3(NC_2)* A5(NC_3)* A11(NC_4)* B3(NC_5)* B4(NC_6)* B5(NC_7)* C4(NC_8)* C5(NC_9)* C11(NC_10)* F11(DTR1#)* G9(RTS1#)* J1(CLKREQ#)* J6(TMS)* K5(NC_11)* K6(TCK)* K7(TDO)* K11(DTR0#)* L1(NC_12)* L6(TRST#)* L7(TDI)* L10(RTS0#)* L11(NC_13)*; U17 7(NC)*

### Layout directives
differential pair; differential pair class PCIe: PCIE_CLK_N, PCIE_CLK_P, PCIE_RX_N, PCIE_RX_P, PCIE_TX_N, PCIE_TX_P

### Notes on the sheet
- (near U16) PCIe 2 Port UART Bridge
- VCC33_B Decoupling
- IR Mode
- 485 Mode
- (near U17) PCIe Vendor EEPROM

### Library data of the parts
C11 C61-C64 C67-C70 C73 C75-C77 = CMP-2100-03641-2: as C24 on sheet CM4_HDMI; RoHS: TRUE; Temperature Characteristic: X7R; Octopart: https://octopart.com/grm155r71c104ka88d-murata-196880; Digikey Description: CAP CER 0.1UF 16V X7R 0402; Device Class L3: Ceramic Capacitors; Height: 0.55mm; ComponentLink2Description: Datasheet; Temperature Range Low: -55°C; Ipc Land Pattern Name: CAPC10050X219; ComponentLink2URL: https://search.murata.co.jp/Ceramy/image/img/A01X/G101/ENG/GRM155R71H471KA01-01A.pdf; Device Class L1: Passive Components; Lead Free: yes; Category: Cap; Package: GRM15; Temperature: -55°C to +125°C; Device Class L2: Capacitors; Temperature Range High: +125°C; Mouser Description: 0402 0.1 uF 16V ±10 % Tolerance X7R SMT Multilayer Ceramic Capacitor
C65 C66 C71 C74 = CMP-06035-045466-1: Chip Multilayer Ceramic Capacitors for General Purpose, 0603, 10uF, X5R, 15%, 20%, 35V; Case Code (Imperial): 0603; Voltage Rating (DC): 35V; Width: 0.031inch; Dielectric: X5R; Voltage Rating: 35V; Min Operating Temperature: -55°C; Thickness: 0.039inch; Mount: Surface Mount; Case/Package: 0603; Length: 0.063inch; Capacitance: 10uF; Max Operating Temperature: 85°C; Packaging: Tape and Reel; Tolerance: 20%; Case Code (Metric): 1608
C72 = CMP-2000-05451-2: Multilayer Ceramic Capacitors 47μF ±20% 10V X5R SMD 0805; RoHS Compliant: Yes; Dielectric: X5R; Case Code (Imperial): 0805; Min Operating Temperature: -55°C; Capacitance: 47uF; Length: 2mm; Voltage Rating: 10V; Lead Free: Lead Free; Weight: 0.000194oz; Resistor Type: Ceramic; Dielectric Material: Ceramic; Max Operating Temperature: 85°C; Height: 1.25mm; Width: 0.049inch; Depth: 1.25mm; Termination: SMD/SMT; Case/Package: 0805; Voltage Rating (DC): 10V; Voltage: 10V; Thickness: 0.057inch; Tolerance: 20%; REACH SVHC: No SVHC; Package Quantity: 1; Series: C; Case Code (Metric): 2012; Mount: Surface Mount; Packaging: Tape and Reel
FB8-FB10 = CMP-03232-000001-1: FERRITE BEAD 1 KOHM 0805 1LN; Tolerance: 25%; Lead/Base Style: SMD/SMT; Max DC Current: 350mA; Number of Lines: 1; Impedance: 1kR; DC Resistance (DCR): 300mR; Resistor Type: Ferrite Bead; Depth: 1.4mm; Height: 1.1mm; Case/Package: 0805; Number of Pins: 2; Case Code (Imperial): 0805; ELV: Compliant; Packaging: Tape and Reel; Mount: Surface Mount; Max Current Rating: 350mA; Max Operating Temperature: 125°C; Series: BMB-L; Core Material: Ferrite; Min Operating Temperature: -55°C; RoHS Compliant: Yes; Case Code (Metric): 2012
L4 = CMP-14484-001484-1: SMD Power Inductors 4.7uH ±20% 0.77A 0.13Ω; Saturation Current: 770mA; Self Resonant Frequency: 48MHz; RMS Current (Irms): 980mA; Test Frequency: 100kHz; Core Material: Ferrite; Shielding: Shielded; DC Resistance (DCR): 156mR; Series: NR; Case Code (Metric): 3030; Halogen Free: Halogen Free; Tolerance: 20%; Resistor Type: Wirewound; Mount: Surface Mount; Case/Package: 1212; Max DC Current: 770mA; Length: 0.118inch; Height - Seated (Max): 0.047inch; Termination: SMD/SMT; Package Quantity: 2000; DC Current: 980mA; Depth: 3.1mm; Packaging: Tape and Reel; Height: 1.2mm; Current Rating: 980mA; Min Operating Temperature: -25°C; Case Code (Imperial): 1212; Lead Free: Lead Free; Military Standard: Not; Width: 0.118inch; Max Operating Temperature: 120°C; Radiation Hardening: No; Inductance: 4.7uH; Inductance Tolerance: 20%; RoHS Compliant: Yes
R1 R2 R8 R35-R39 R41-R65 = CMP-2002-01154-4: Chip Resistor, 4.7 KOhm, +/- 1%, 0.1 W, -55 to 155 degC, 0402 (1005 Metric), RoHS, Tape and Reel; PartNumber: ERJ-2RKF4701X; Voltage Rating: 50 V; Case\/Package: 0402; Power Rating: 100 mW; Height: 0.35 mm; Mounting Technology: Surface Mount; REACH SVHC: Yes; Resistance: 4.7 KOhm; Max Operating Temperature: 155 degC; ComponentLink1Description: Manufacturer URL; ComponentLink2Description: Datasheet; Pins: 2; PackageReference: 0402; Tolerance: 1%; Case Code (Imperial): 0402; Length: 1 mm; PackageDescription: 2-Pin Surface Mount Device, Body 1 x 0.5 mm; RoHSCompliant: true; Package Quantity: 1; Radiation Hardening: No; DatasheetVersion: 04/2015; Width: 0.5 mm; Case Code (Metric): 1005; Mount: Surface Mount; ComponentLink1URL: http://www.panasonic.com/; Min Operating Temperature: -55 degC; Packaging: Cut Tape; ComponentLink2URL: http://industrial.panasonic.com/cdbs/www-data/pdf/RDA0000/AOA0000C86.pdf
R34 = CMP-1011-00427-2: Manufacturer: Panasonic; Part Number: ERJ-2RKF1910X
R40 = CMP-2002-01154-4: PartNumber: ERJ-2RKF4701X; Resistance: 4.7 KOhm; Tolerance: 1%; Voltage Rating: 50 V; Case\/Package: 0402; Power Rating: 100 mW; Height: 0.35 mm; Mounting Technology: Surface Mount; REACH SVHC: Yes; Max Operating Temperature: 155 degC; ComponentLink1Description: Manufacturer URL; ComponentLink2Description: Datasheet; Pins: 2; PackageReference: 0402; Case Code (Imperial): 0402; Length: 1 mm; PackageDescription: 2-Pin Surface Mount Device, Body 1 x 0.5 mm; RoHSCompliant: true; Package Quantity: 1; Radiation Hardening: No; DatasheetVersion: 04/2015; Width: 0.5 mm; Case Code (Metric): 1005; Mount: Surface Mount; ComponentLink1URL: http://www.panasonic.com/; Min Operating Temperature: -55 degC; Packaging: Cut Tape; ComponentLink2URL: http://industrial.panasonic.com/cdbs/www-data/pdf/RDA0000/AOA0000C86.pdf
U16 = XR17V352IB113-F: Integrated Circuit; Manufacturer_Name: MaxLinear; Datasheet Link: https://www.mouser.com/datasheet/2/146/XR17V352-536180.pdf; Height: 1.53mm; Manufacturer_Part_Number: XR17V352IB113-F; Mouser Part Number: 701-XR17V352IB113-F; Mouser Price/Stock: https://www.mouser.co.uk/ProductDetail/MaxLinear/XR17V352IB113-F?qs=j9wFvaVy6jcT7uc4HigktQ%3D%3D; Arrow Part Number: XR17V352IB113-F; Arrow Price/Stock: https://www.arrow.com/en/products/xr17v352ib113-f/maxlinear-inc?region=nac
U17 = CMP-06313-000016-1: IC EEPROM 1K SPI 2MHZ 8SOIC; Manufacturer: Microchip; Nominal Supply Current: 0.5mA; Memory Size: 1Kbits; Access Time: 1000ns; Max Supply Voltage: 5.5V; Interface: Other; Standoff Height: 0.1mm; Min Supply Voltage: 1.8V; Category: IC; Temperature Range High: +85°C; Mouser Description: EEPROM Serial-3Wire 1K-Bit 128 x 8/64 x 16 2.5V/3.3V/5V 8-Pin SOIC T/R; Ipc Land Pattern Name: SOIC127P600X175-8; Temperature Range Low: -40°C; Temperature: -40°C to +85°C; Digikey Description: IC EEPROM 1K SPI 2MHZ 8SOIC; Lead Free: Yes; Device Class L2: Memory; ComponentLink2URL: http://ww1.microchip.com/downloads/en/DeviceDoc/20006224B.pdf; Automotive: No; Device Class L3: EEPROM; Package: C04-057-SN; Octopart: https://octopart.com/at93c46dn-sh-t-microchip-77759177; RoHS: TRUE; Memory Type: EEPROM; Height: 1.75mm; Manufacturer Part Number: AT93C46DN-SH-T; ComponentLink2Description: Datasheet; Frequency: 2MHz; Device Class L1: Integrated Circuits (ICs)

## Sheet PCIe_Connector.SchDoc: Grandmaster PCIe & JTAG Connectors
size A; Author: N Smith; Revision: A; SheetNumber: 3; SheetTotal: 11; Customer: 01910
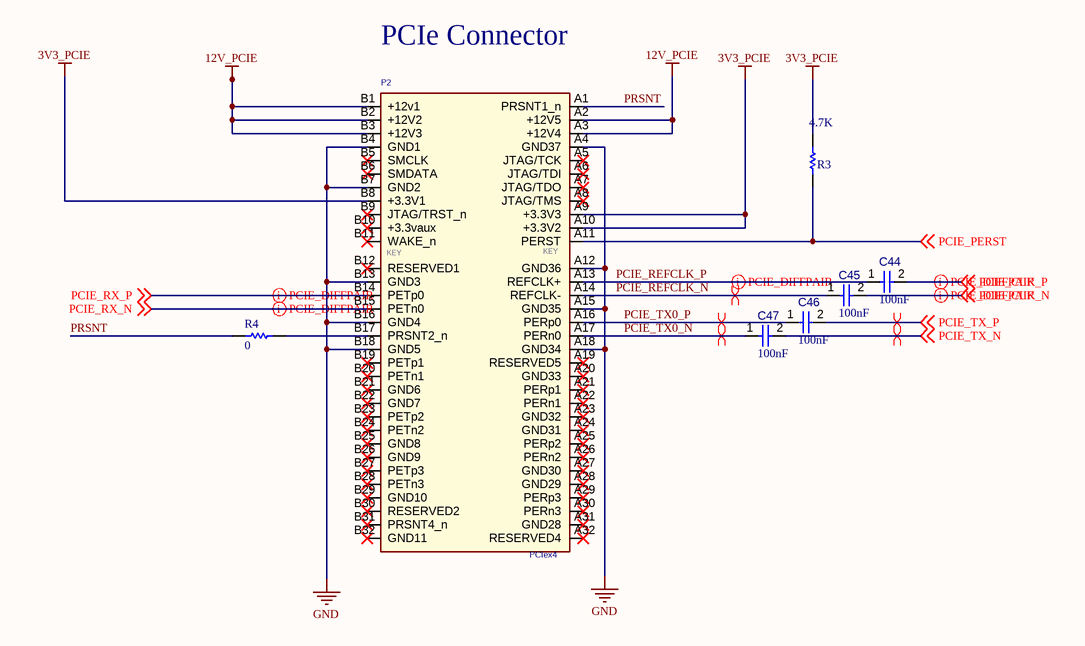
[diagram p4: PCIe_Connector.SchDoc]

### Parts
C44  value 100nF  [CAPC1005X56X25LL10T15]  (hidden comment: Capacitor 0.1 uF +/- 5% 16 V 0402)
C45  value 100nF  [CAPC1005X56X25LL10T15]  (hidden comment: Capacitor 0.1 uF +/- 5% 16 V 0402)
C46  value 100nF  [CAPC1005X56X25LL10T15]  (hidden comment: Capacitor 0.1 uF +/- 5% 16 V 0402)
C47  value 100nF  [CAPC1005X56X25LL10T15]  (hidden comment: Capacitor 0.1 uF +/- 5% 16 V 0402)
P2  PCIex4  [PCIE_4LANE_EDGE]
R3  4.7K  [RESC1005X40X25LL05T05]
R4  value 0  [RESC1005X40X25ML05T10]  (hidden comment: Resistor 0R 0402 63 mW)

### Nets
3V3_PCIE: P2.A9(+3.3V3) P2.A10(+3.3V2) P2.B8(+3.3V1) R3.2
12V_PCIE: P2.A2(+12V5) P2.A3(+12V4) P2.B1(+12v1) P2.B2(+12V2) P2.B3(+12V3)
GND: P2.A4(GND37) P2.A12(GND36) P2.A15(GND35) P2.A18(GND34) P2.B4(GND1) P2.B7(GND2) P2.B13(GND3) P2.B16(GND4) P2.B18(GND5)
PCIE_CLK_N: C45.2 ; off-sheet PCIE_CLK_N
PCIE_CLK_P: C44.2 ; off-sheet PCIE_CLK_P
PCIE_PERST: P2.A11(PERST) R3.1 ; off-sheet PCIE_PERST
PCIE_REFCLK_N: C45.1 P2.A14(REFCLK-)
PCIE_REFCLK_P: C44.1 P2.A13(REFCLK+)
PCIE_RX_N: P2.B15(PETn0) ; off-sheet PCIE_RX_N
PCIE_RX_P: P2.B14(PETp0) ; off-sheet PCIE_RX_P
PCIE_TX0_N: C47.1 P2.A17(PERn0)
PCIE_TX0_P: C46.1 P2.A16(PERp0)
PCIE_TX_N: C47.2 ; off-sheet PCIE_TX_N
PCIE_TX_P: C46.2 ; off-sheet PCIE_TX_P
PRSNT: P2.A1(PRSNT1_n) R4.1
NetP2_B17: P2.B17(PRSNT2_n) R4.2

Not connected (* = marked no-connect by the designer): P2 A5(JTAG/TCK)* A6(JTAG/TDI)* A7(JTAG/TDO)* A8(JTAG/TMS)* A19(RESERVED5)* A20(GND33)* A21(PERp1)* A22(PERn1)* A23(GND32)* A24(GND31)* A25(PERp2)* A26(PERn2)* A27(GND30)* A28(GND29)* A29(PERp3)* A30(PERn3)* A31(GND28)* A32(RESERVED4)* B5(SMCLK)* B6(SMDATA)* B9(JTAG/TRST_n)* B10(+3.3vaux)* B11(WAKE_n)* B12(RESERVED1)* B19(PETp1)* B20(PETn1)* B21(GND6)* B22(GND7)* B23(PETp2)* B24(PETn2)* B25(GND8)* B26(GND9)* B27(PETp3)* B28(PETn3)* B29(GND10)* B30(RESERVED2)* B31(PRSNT4_n)* B32(GND11)*

### Layout directives
differential pair; differential pair class PCIe: PCIE_CLK_N, PCIE_CLK_P, PCIE_REFCLK_N, PCIE_REFCLK_P, PCIE_RX_N, PCIE_RX_P, PCIE_TX0_N, PCIE_TX0_P, PCIE_TX_N, PCIE_TX_P

### Notes on the sheet
- PCIe Connector
- SHEET
- timingcard.com <http://timingcard.com>
- OF
- (in symbol PCIex4) KEY

### Library data of the parts
C44-C47 = CMP-001-00001-6: Chip Capacitor, 0.1 uF, +/- 5%, 16 V, 0402 (1005 Metric); Capacitor Type: Ceramic; Voltage Rating: 16V; Max Operating Temperature: 125°C; Min Operating Temperature: -55°C; Case/Package: 0402; Mounting Technology: SM; Pins: 2; Tolerance: 5%; RoHS Compliant: True
P2 = PCIex4: PCIE x4 Edge Connector,OrCAD Symbol,NC; Part Number: 451; Manufacturer: NA; NOTE: NC; Vendor P/N: NA; Part Type: SMT
R3 = CMP-2002-01154-4: as R1 on sheet PCIe_UART_Bridge; Height: 0.35 mm; Mounting Technology: Surface Mount; REACH SVHC: Yes; Resistance: 4.7 KOhm; Max Operating Temperature: 155 degC; ComponentLink1Description: Manufacturer URL; ComponentLink2Description: Datasheet; Pins: 2; PackageReference: 0402; Tolerance: 1%; Case Code (Imperial): 0402; Length: 1 mm; PackageDescription: 2-Pin Surface Mount Device, Body 1 x 0.5 mm; RoHSCompliant: true; Package Quantity: 1; Radiation Hardening: No; DatasheetVersion: 04/2015; Width: 0.5 mm; Case Code (Metric): 1005; Mount: Surface Mount; ComponentLink1URL: http://www.panasonic.com/; Min Operating Temperature: -55 degC; Packaging: Cut Tape; ComponentLink2URL: http://industrial.panasonic.com/cdbs/www-data/pdf/RDA0000/AOA0000C86.pdf
R4 = CMP-009-00004-5: Chip Resistor, 0 Ohm, 0.063 W, -55 to 155 degC, 0402 (1005 Metric); Power: 63mW; Voltage Rating: 50V; Max Operating Temperature: 155°C; Pins: 2; RoHS Compliant: True; Min Operating Temperature: -55°C; Mounting Technology: SM; Case/Package: 0402

## Sheet Power.SchDoc
size A4; SheetNumber: 4; SheetTotal: 11
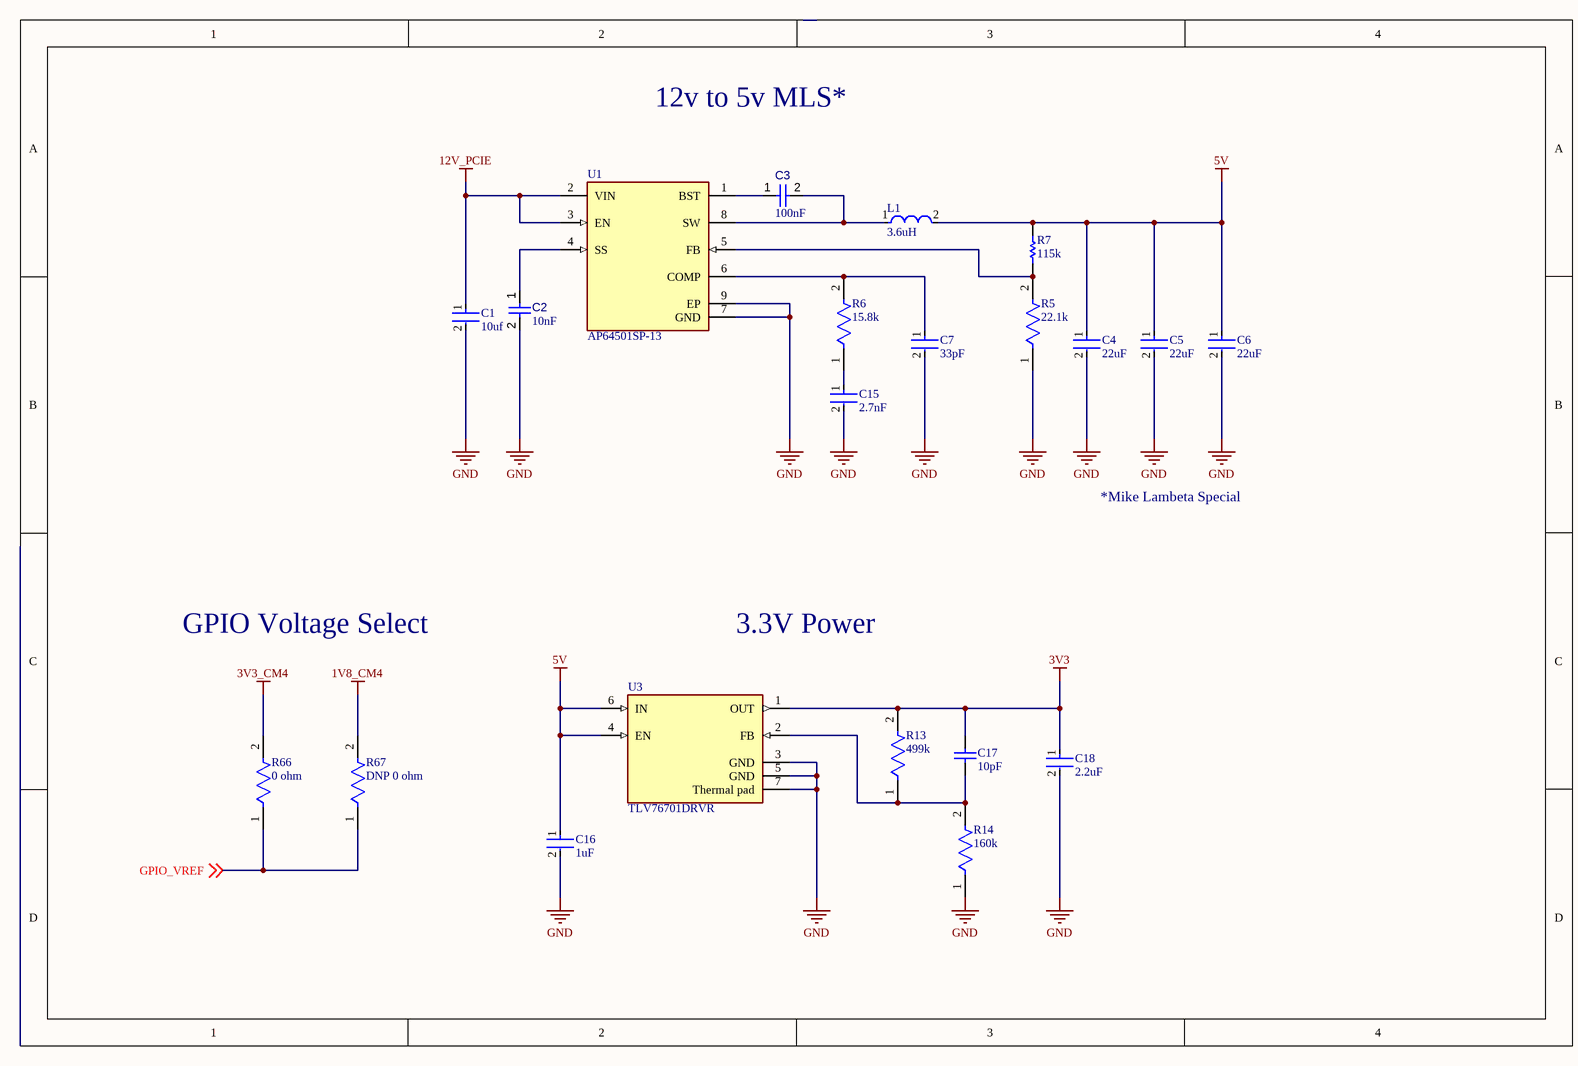
[diagram p5: Power.SchDoc]

### Parts
C1  10uf  [FP-GRM188-0_2-IPC_C]
C2  value 10nF  [CAPC0402(1005)60_L]  (hidden comment: Capacitor 10nF +/-20% 50V 0402)
C3  value 100nF  [CAPC0402(1005)60_L]  (hidden comment: Capacitor 100nF +/-20% 25V 0402)
C4  22uF  [FP-GRM21B-0_15-MFG]
C5  22uF  [FP-GRM21B-0_15-MFG]
C6  22uF  [FP-GRM21B-0_15-MFG]
C7  33pF  [FP-0402-L_1_0_1-W_0_5_0_1-IPC_A]
C15  2.7nF  [FP-CL10-IPC_C]
C16  1uF  [FP-CC0805-0_85-MFG]
C17  10pF  [CAPC1005X55X25ML05T05]
C18  2.2uF  [FP-CC0603-DA-MFG]
L1  3.6uH  [FP-NR8040-H_4_2-MFG]
R5  22.1k  [FP-CRCW0402-e3-IPC_A]
R6  15.8k  [FP-CRCW0402-e3-IPC_C]
R7  115k  [RESC1005X40X25ML05T05]
R13  499k  [FP-CRCW0805-e3-MFG]
R14  160k  [FP-CRCW0805-e3-IPC_C]
R66  0 ohm  [FP-CRCW0603-HPe3-MFG]
R67  DNP 0 ohm  [FP-CRCW0603-HPe3-MFG]
U1  AP64501SP-13  [FP-SO-8EP-IPC_A]
U3  TLV76701DRVR  [FP-DRV0006A-IPC_C]

### Nets
1V8_CM4: R67.2
3V3: C17.2 C18.1 R13.2 U3.1(OUT)
3V3_CM4: R66.2
5V: C4.1 C5.1 C6.1 C16.1 L1.2 R7.2 U3.4(EN) U3.6(IN)
12V_PCIE: C1.1 U1.2(VIN) U1.3(EN)
GND: C1.2 C2.2 C4.2 C5.2 C6.2 C7.2 C15.2 C16.2 C18.2 R5.1 R14.1 U1.7(GND) U1.9(EP) U3.3(GND) U3.5(GND) U3.7(Thermal_pad)
GPIO_VREF: R66.1 R67.1 ; off-sheet GPIO_VREF
NetC2_1: C2.1 U1.4(SS)
NetC3_1: C3.1 U1.1(BST)
NetC3_2: C3.2 L1.1 U1.8(SW)
NetC7_1: C7.1 R6.2 U1.6(COMP)
NetC15_1: C15.1 R6.1
NetC17_1: C17.1 R13.1 R14.2 U3.2(FB)
NetR5_2: R5.2 R7.1 U1.5(FB)

### Notes on the sheet
- 12v to 5v MLS*
- *Mike Lambeta Special
- GPIO Voltage Select
- 3.3V Power

### Library data of the parts
C1 = CMP-06035-045466-1: as C65 on sheet PCIe_UART_Bridge; Case Code (Imperial): 0603; Voltage Rating (DC): 35V; Width: 0.031inch; Dielectric: X5R; Voltage Rating: 35V; Min Operating Temperature: -55°C; Thickness: 0.039inch; Mount: Surface Mount; Case/Package: 0603; Length: 0.063inch; Capacitance: 10uF; Max Operating Temperature: 85°C; Packaging: Tape and Reel; Tolerance: 20%; Case Code (Metric): 1608
C2 = CMP-001-00069-3: Chip Capacitor, 10nF +/-20%, 50V, 0402, Thickness 0.6 mm; Tolerance: 5%; Max Operating Temperature: 85°C; Pins: 2; Case/Package: 0402; Voltage Rating: 50V; Min Operating Temperature: -55°C; Mounting Technology: SMT
C3 = CMP-001-00065-4: Chip Capacitor, 100nF +/-20%, 25V, 0402, Thickness 0.6 mm; Tolerance: 10%; Max Operating Temperature: 85°C; Min Operating Temperature: -55°C; Pins: 2; Voltage Rating: 25V; Mounting Technology: SMT; Case/Package: 0402
C4-C6 = CMP-2007-03385-2: Chip Multilayer Ceramic Capacitors for General Purpose, 0805, 22uF, X5R, 15%, 20%, 6.3V; Material: Ceramic; Max Operating Temperature: 85°C; Voltage: 6.3V; Min Operating Temperature: -55°C; Case/Package: 0805; Thickness: 0.053inch; Dielectric: X5R; Packaging: Tape and Reel; Depth: 1.25mm; Termination: SMD/SMT; Voltage Rating (DC): 6.3V; Radiation Hardening: No; Tolerance: 20%; Mount: Surface Mount; Lead Free: Lead Free; Package Quantity: 1; REACH SVHC: No SVHC; Voltage Rating: 6.3V; Capacitance: 22uF; Length: 2mm; Case Code (Imperial): 0805; Case Code (Metric): 2012; Width: 0.049inch; Height: 1.25mm
C7 = CMP-2008-02637-2: General Purpose Ceramic Capacitor, 0402, 33pF, 5%, C0G, 30ppm/°C, 50V; Insulation Resistance: 100GR; REACH SVHC: No SVHC; Radiation Hardening: No; Voltage Rating (DC): 50V; Tolerance: 5%; Voltage Rating: 50V; Mount: Surface Mount; Packaging: Tape and Reel; Construction: Flat; Voltage: 50V; Case/Package: 0402; Temperature Coefficient: 30ppm/°C; Lead Free: Lead Free; Case Code (Metric): 1005; Number of Pins: 2; Min Operating Temperature: -55°C; Capacitance: 33pF; Width: 0.5mm; Dielectric: C0G; Height: 0.5mm; Thickness: 0.022inch; Contact Plating: Tin; Length: 1mm; Package Quantity: 1; Depth: 0.5mm; Termination: SMD/SMT; Max Operating Temperature: 125°C; RoHS Compliant: Yes; Case Code (Imperial): 0402; Series: -
C15 = CMP-13271-000201-1: Cap Ceramic 2.7nF 50V X7R ±10% Pad SMD 0603 +125°C T/R; Thickness: 0.035inch; Capacitance: 2.7nF; Radiation Hardening: No; Height: 0.8mm; Tolerance: 10%; Case Code (Metric): 1608; Voltage: 50V; Voltage Rating: 50V; Package Quantity: 1; Packaging: Tape and Reel; Depth: 0.8mm; Material: Ceramic; Length: 1.6mm; Width: 0.031inch; Case Code (Imperial): 0603; Dielectric: X7R; Max Operating Temperature: 125°C; Case/Package: 0603; Min Operating Temperature: -55°C; Contact Plating: Tin; Mount: Surface Mount
C16 = CMP-03422-000182-1: CAP CER 1UF 10V X7R 0805; Manufacturer: Yageo; Manufacturer Part Number: CC0805KKX7R6BB105; Material: Ceramic; Tolerance: 0.1; Value: 1 uF; ComponentLink2URL: http://www.yageo.com/documents/recent/UPY-GPHC_Y5V_6.3V-to-50V_8.pdf; Automotive: No; Temperature Range Low: -30°C; Octopart: https://octopart.com/cc0805kkx7r6bb105-yageo-42522859; Temperature Characteristic: X7R; RoHS: TRUE; Voltage Rating: 10 V; Capacitance: 1 uF; Package: CC0805-0.85; Device Class L3: Ceramic Capacitors; Category: Cap; Mouser Description: Multilayer Ceramic Capacitors MLCC - SMD/SMT 1.0uF 10V X7R 10%; Temperature Range High: +85°C; Ipc Land Pattern Name: CAPC200125X85; ComponentLink2Description: Datasheet; Temperature: -30°C to +85°C; Height: 0.95mm; Lead Free: Yes; Device Class L1: Passive Components; Device Class L2: Capacitors; Footprint Url: http://www.yageo.com/exep/pages/download/literatures/UPY-C_GEN_24.pdf; Digikey Description: CAP CER 1UF 10V X7R 0805
C17 = CMP-2100-03589-1: Chip Capacitor, 10 pF, +/- 5%, 50 V, -55 to 125 degC, 0402 (1005 Metric), RoHS, Tape and Reel; Manufacturer: Yageo; Insulation Resistance: 100GR; Voltage Rating (DC): 50V; Dielectric Material: Ceramic; Temperature Coefficient: 30ppm/degC; Dielectric: C0G; Termination: SMD/SMT; Package Reference: 0402; Lead Free: LeadFree; Composition: Ceramic; Tolerance: 5%; Case Code (Metric): 1005; Voltage Rating: 50V; Packaging: TapeandReel; Manufacturer URL: http://www.yageo.com/; REACH SVHC: NoSVHC; Max Operating Temperature: 125degC; Length: 1mm; Mount: SurfaceMount; Depth: 0.5mm; Min Operating Temperature: -55degC; Number of Pins: 2; Width: 0.02inch; Datasheet Version: Rev. 14, 07/2016; Package Quantity: 1; Datasheet URL: http://www.yageo.com/documents/recent/UPY-GP_NP0_16V-to-50V_14.pdf; Case Code (Imperial): 0402; RoHSCompliant: True; Radiation Hardening: No; Height: 0.5mm; Case/Package: 0402; Thickness: 0.022inch; Capacitance: 10pF; Package Description: 2-Pin Surface Mount Device, Body 1 x 0.5 mm; Voltage: 50V
C18 = CMP-2000-06073-2: CAP CER 2.2UF 10V X5R 0603; Manufacturer: YAGEO; Manufacturer Part Number: CC0603KRX5R6BB225; Tolerance: 0.1; Temperature Coefficient: 15%; Material: Ceramic; Lead Free: Yes; Temperature: -55°C to +125°C; Category: Cap; Device Class L2: Capacitors; Device Class L3: Ceramic Capacitors; Voltage: 10 V; RoHS: TRUE; Octopart: https://octopart.com/cc0603krx5r6bb225-yageo-8376528; Temperature Characteristic: X5R; Capacitance: 2.2 uF; ComponentLink2URL: http://www.yageo.com/documents/recent/UPY-GPHC_X7R_6.3V-to-50V_18.pdf; Package: CC0603-DA; Footprint Url: http://www.yageo.com/exep/pages/download/literatures/UPY-C_GEN_24.pdf; Device Class L1: Passive Components; Digikey Description: CAP CER 2.2UF 10V X5R 0603; Temperature Range Low: -55°C; ComponentLink2Description: Datasheet; Value: 2.2 uF; Mouser Description: Multilayer Ceramic Capacitors MLCC - SMD/SMT 2.2uF 10V X5R 10%; Temperature Range High: +125°C; Height: 0.9mm; Voltage Rating: 10 V; Automotive: No
L1 = CMP-14484-000604-1: Shielded Wirewound Inductor 3.6uH 30% 6A 19.5mΩ SMD Automotive; DC Resistance (DCR): 19.5mR; Self Resonant Frequency: 34MHz; Core Material: Ferrite; Saturation Current: 6.4A; Test Frequency: 100kHz; Current Rating: 4.9A; Min Operating Temperature: -40°C; Height - Seated (Max): 0.157inch; Shielding: Shielded; Inductance: 3.6uH; Length: 0.315inch; Max Operating Temperature: 125°C; Packaging: Tape and Reel; Width: 0.315inch; Case/Package: Nonstandard; Resistor Type: Wirewound; RoHS Compliant: Yes; Tolerance: 30%; Mount: Surface Mount
R5 = CMP-2002-08380-2: RES Thick Film, 22.1kΩ, 1%, 0.063W, 100ppm/°C, 0402; Voltage Rating: 50V; Resistance: 22.1kR; Power Rating: 63mW; Length: 1mm; Termination: SMD/SMT; Height: 0.35mm; Package Quantity: 10000; Depth: 0.5mm; Lead Free: Lead Free; Packaging: Tape and Reel; Case/Package: 0402; Max Operating Temperature: 155°C; Composition: Thick Film; Min Operating Temperature: -55°C; Working Voltage: 50V; Number of Pins: 2; Contact Plating: Tin; Mount: Surface Mount; Case Code (Imperial): 0402; Temperature Coefficient: 100ppm/°C; Tolerance: 1%; Voltage Rating (DC): 50V; Width: 0.5mm; Number of Terminations: 2; Radiation Hardening: No; Weight: 2.3E-05oz; Military Standard: Not; Case Code (Metric): 1005
R6 = CMP-2002-08223-2: RES Thick Film, 15.8kΩ, 1%, 0.063W, 100ppm/°C, 0402; Resistance: 15.8kR; Voltage Rating: 50V; Max Power Dissipation: 63mW; Contact Plating: Tin; Weight: 2.3E-05oz; Temperature Coefficient: 100ppm/°C; Case Code (Imperial): 0402; Number of Pins: 2; Length: 1mm; Case Code (Metric): 1005; Package Quantity: 10; Termination: SMD/SMT; Number of Terminations: 2; Radiation Hardening: No; Lead Free: Lead Free; Features: Automotive AEC-Q200; Packaging: Tape and Reel; Case/Package: 0402; Voltage Rating (DC): 50V; Max Operating Temperature: 155°C; Depth: 0.5mm; Composition: Thick Film; Tolerance: 1%; Height: 0.016inch; Min Operating Temperature: -55°C; Mount: Surface Mount; Width: 0.02inch; Power Rating: 63mW; Military Standard: Not
R7 = CMP-1011-00742-2: Manufacturer: Panasonic; Part Number: ERJ-2RKF1153X
R13 = CMP-02407-008566-1: RES Thick Film, 499kΩ, 1%, 0.125W, 100ppm/°C, 0805; Max Power Dissipation: 125mW; Voltage Rating: 150V; Resistance: 499kR; Width: 0.049inch; Case Code (Imperial): 0805; Features: Automotive AEC-Q200; Termination: SMD/SMT; Height: 0.02inch; Package Quantity: 10000; Contact Plating: Tin; Temperature Coefficient: 100ppm/°C; Min Operating Temperature: -55°C; Number of Terminations: 2; Packaging: Tape and Reel; Tolerance: 1%; Power Rating: 125mW; Composition: Thick Film; Length: 0.079inch; Case Code (Metric): 2012; Max Operating Temperature: 155°C; Weight: 0.000194oz; Lead Free: Lead Free; Case/Package: 0805; Radiation Hardening: No
R14 = CMP-1013-00757-2: RES Thick Film, 160kΩ, 1%, 0.125W, 100ppm/°C, 0805; Voltage Rating: 150V; Power Rating: 125mW; Resistance: 160kR; Width: 1.25mm; Case/Package: 0805; Package Quantity: 5000; Temperature Coefficient: 100ppm/°C; Length: 2mm; Height: 0.45mm; Weight: 0.000194oz; Mount: Surface Mount; Case Code (Metric): 2012; Min Operating Temperature: -55°C; Termination: SMD/SMT; Case Code (Imperial): 0805; Number of Pins: 2; Packaging: Tape and Reel; Max Operating Temperature: 155°C; Radiation Hardening: No; Military Standard: Not; Depth: 1.25mm; Tolerance: 1%; Composition: Thick Film; Contact Plating: Tin
R66 R67 = CMP-2000-03817-2: RES Thick Film, 0Ω, , 0.33W, , 0603; Max Power Dissipation: 250mW; Voltage Rating (DC): 75V; Temperature Coefficient: 0ppm/°C; Resistance: 0mR; Mount: Surface Mount; Package Quantity: 5000; Features: Automotive AEC-Q200; Length: 1.6mm; Width: 0.033inch; Min Operating Temperature: -55°C; Max Operating Temperature: 155°C; Contact Plating: Tin; Depth: 0.85mm; Case/Package: 0603; Radiation Hardening: No; Military Standard: Not; Power Rating: 250mW; Height: 0.45mm; Composition: Thick Film; Lead Free: Lead Free; Voltage Rating: 75V; Case Code (Imperial): 0603; Weight: 7.1E-05oz; Number of Terminations: 2; Packaging: Tape and Reel; Number of Pins: 2; Case Code (Metric): 1608; Termination: SMD/SMT
U1 = CMP-12757-000024-1: DCDC CONV HV BUCK SO-8EP
U3 = CMP-04917-000172-1: IC REG LINEAR POS ADJ 1A 6WSON

## Sheet External_Connectors.SchDoc
size A4; SheetNumber: 5; SheetTotal: 11
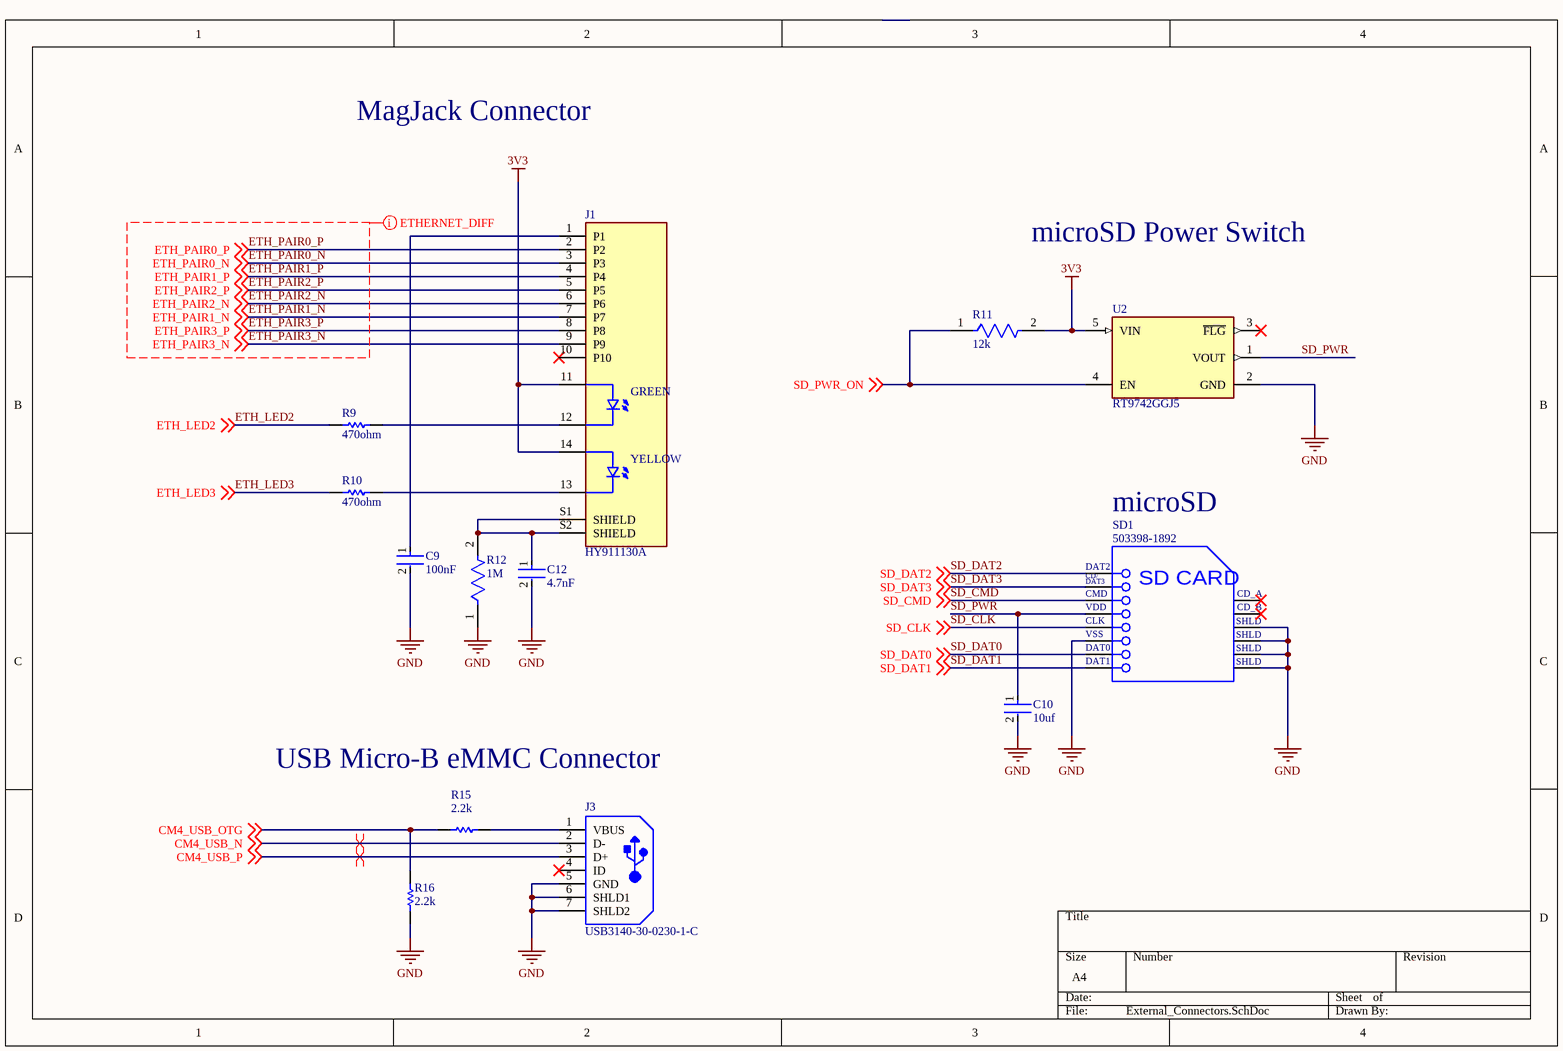
[diagram p6: External_Connectors.SchDoc]

### Parts
C9  100nF  [FP-C0402-BB-MFG]
C10  10uf  [FP-GRM188-0_2-IPC_C]
C12  4.7nF  [FP-0805-L_2_01_0_2-W_1_25-IPC_B]
J1  HY911130A  [HANRUN_HR911130A]
J3  USB3140-30-0230-1-C  [GCT-USB3140_V]
R9  470ohm  [RESC1005X40X25ML05T10]
R10  470ohm  [RESC1005X40X25ML05T10]
R11  12k  [FP-RC0402-0_4-IPC_C]
R12  1M  [FP-ERJ6EN-IPC_A]
R15  2.2k  [RESC1005X40X25LL05T05]
R16  2.2k  [RESC1005X40X25LL05T05]
SD1  503398-1892  [MOLX-503398-1892_V]
U2  RT9742GGJ5  [FP-RT9742GGJ5-IPC_C]

### Nets
3V3: J1.11 J1.14 R11.2 U2.5(VIN)
GND: C9.2 C10.2 C12.2 J3.5(GND) J3.6(SHLD1) J3.7(SHLD2) R12.1 R16.1 SD1.6(VSS) SD1.11(SHLD) SD1.12(SHLD) SD1.13(SHLD) SD1.14(SHLD) U2.2(GND)
CM4_USB_N: J3.2(D-) ; off-sheet CM4_USB_N
CM4_USB_OTG: R15.1 R16.2 ; off-sheet CM4_USB_OTG
CM4_USB_P: J3.3(D+) ; off-sheet CM4_USB_P
ETH_LED2: R9.1 ; off-sheet ETH_LED2
ETH_LED3: R10.1 ; off-sheet ETH_LED3
ETH_PAIR0_N: J1.3(P3) ; off-sheet ETH_PAIR0_N
ETH_PAIR0_P: J1.2(P2) ; off-sheet ETH_PAIR0_P
ETH_PAIR1_N: J1.7(P7) ; off-sheet ETH_PAIR1_N
ETH_PAIR1_P: J1.4(P4) ; off-sheet ETH_PAIR1_P
ETH_PAIR2_N: J1.6(P6) ; off-sheet ETH_PAIR2_N
ETH_PAIR2_P: J1.5(P5) ; off-sheet ETH_PAIR2_P
ETH_PAIR3_N: J1.9(P9) ; off-sheet ETH_PAIR3_N
ETH_PAIR3_P: J1.8(P8) ; off-sheet ETH_PAIR3_P
SD_CLK: SD1.5(CLK) ; off-sheet SD_CLK
SD_CMD: SD1.3(CMD) ; off-sheet SD_CMD
SD_DAT0: SD1.7(DAT0) ; off-sheet SD_DAT0
SD_DAT1: SD1.8(DAT1) ; off-sheet SD_DAT1
SD_DAT2: SD1.1(DAT2) ; off-sheet SD_DAT2
SD_DAT3: SD1.2(CD/DAT3) ; off-sheet SD_DAT3
SD_PWR: C10.1 SD1.4(VDD) U2.1(VOUT)
SD_PWR_ON: R11.1 U2.4(EN) ; off-sheet SD_PWR_ON
NetC9_1: C9.1 J1.1(P1)
NetC12_1: C12.1 J1.S1(SHIELD) J1.S2(SHIELD) R12.2
NetJ1_12: J1.12 R9.2
NetJ1_13: J1.13 R10.2
NetJ3_1: J3.1(VBUS) R15.2

Not connected (* = marked no-connect by the designer): J1 10(P10)*; J3 4(ID)*; SD1 9(CD_A)* 10(CD_B)*; U2 3(~{FLG})*

### Layout directives
differential pair; differential pair class ETHERNET_DIFF_IO; net class ETHERNET_DIFF: ETH_PAIR0_N, ETH_PAIR0_P, ETH_PAIR1_N, ETH_PAIR1_P, ETH_PAIR2_N, ETH_PAIR2_P, ETH_PAIR3_N, ETH_PAIR3_P
differential pair; differential pair class CM4_USB: CM4_USB_N, CM4_USB_P

### Notes on the sheet
- MagJack Connector
- microSD Power Switch
- microSD
- USB Micro-B eMMC Connector
- (in symbol CMP-2000-05621-1) CD/; DAT3; SD CARD
- (in symbol HR911130A) GREEN; YELLOW

### Library data of the parts
C9 = CMP-2008-02046-2: CAP CER 0.1UF 10V X5R 0402; Manufacturer: Kemet; Manufacturer Part Number: C0402C104K8PACTU; Material: Ceramic; Capacitance: 0.10 μF; Temperature Coefficient: 15%; Tolerance: 0.1; Value: 0.10 μF; Package: C0402-BB; Temperature: -55°C to +125°C; ComponentLink2Description: Datasheet; Temperature Characteristic: X5R; Device Class L1: Passive Components; Height: 0.55mm; Lead Free: Yes; ComponentLink2URL: https://content.kemet.com/datasheets/KEM_C1002_X7R_SMD.pdf; Device Class L2: Capacitors; Temperature Range Low: -55°C; Temperature Range High: +125°C; RoHS: TRUE; Octopart: https://octopart.com/c0402c104k8pactu-kemet-140039; Automotive: No; Mouser Description: Capacitor 100 nF 10 VDC 0402; Category: Cap; Voltage Rating: 10 V; Digikey Description: CAP CER 0.1UF 10V X5R 0402; Ipc Land Pattern Name: CAPC10050X50; Device Class L3: Ceramic Capacitors
C10 = CMP-06035-045466-1: as C65 on sheet PCIe_UART_Bridge; Case Code (Imperial): 0603; Voltage Rating (DC): 35V; Width: 0.031inch; Dielectric: X5R; Voltage Rating: 35V; Min Operating Temperature: -55°C; Thickness: 0.039inch; Mount: Surface Mount; Case/Package: 0603; Length: 0.063inch; Capacitance: 10uF; Max Operating Temperature: 85°C; Packaging: Tape and Reel; Tolerance: 20%; Case Code (Metric): 1608
C12 = CMP-1036-03594-3: General Purpose Ceramic Capacitor, 0805, 4.7nF, 10%, X7R, 0.15, 50V; Dissipation Factor: 2.5%; Insulation Resistance: 100GR; Depth: 1.25mm; Width: 1.25mm; Construction: Flat; Series: -; Termination: SMD/SMT; Case Code (Imperial): 0805; Voltage Rating: 50V; Number of Pins: 2; Voltage Rating (DC): 50V; Dielectric Material: Ceramic; Capacitance: 4.7nF; Thickness: 0.037inch; Package Quantity: 1; Mount: Surface Mount; Voltage: 50V; Min Operating Temperature: -55°C; Size: 0.94mm; Packaging: Tape and Reel; Dielectric: X7R; RoHS Compliant: Yes; REACH SVHC: No SVHC; Tolerance: 10%; Length: 2.01mm; Lead Free: Lead Free; Radiation Hardening: No; Case/Package: 0805; Case Code (Metric): 2012; Max Operating Temperature: 125°C; Height: 0.94mm; Contact Plating: Tin
J1 = HR911130A: MF: hanrun; SnapEDA_Link: https://www.snapeda.com/parts/HR911130A/HanRun/view-part/?ref=snap; MP: HY911130A; Price: None; Package: None; Check_prices: https://www.snapeda.com/parts/HR911130A/HanRun/view-part/?ref=eda; Value: *; Availability: Not in stock
J3 = CMP-2000-07368-1: Micro USB Receptacle, Type B, SMT, Vertical, with Through-Hole Shell Stakes, -30 to 85 degC, 5-Pin SMD, RoHS, Tape and Reel; Manufacturer: Global Connector Technology; Connector Mounting: PCB; SVHC: NoSVHC(19-Dec-2012); No. of Positions: 5; Connector Type: USB2.0MicroB; No. of Rows: 1; Contact Termination: SurfaceMountVertical; Pitch: 0.65mm; Contact Material: Copper; Gender: Receptacle; PartNumber: USB3140; Series: USB3140; Datasheet URL: http://www.farnell.com/datasheets/1913332.pdf; Contact Plating: Gold; Manufacturer URL: http://gct.co/; Package Reference: USB3140; No. of Contacts: 5; Orientation: Vertical; Datasheet Version: Rev. B2, 04/2015; Package Description: 5-Pin Surface Mount Device, Body 7.8 x 4 mm, Pitch 0.65 mm; Mounting Technology: SurfaceMount
R9 R10 = CMP-2002-07697-1: Part Number: RC0402FR-07470RL; Manufacturer: Yageo / Phycomp
R11 = CMP-2002-07378-2: RES SMD 12K OHM 1% 1/16W 0402; Power Rating: 62.5mW; Voltage Rating: 50V; Resistance: 12kR; Max Power Dissipation: 63mW; Temperature Coefficient: 100ppm/°C; Construction: Rectangular; Case Code (Metric): 1005; Package Quantity: 1; Weight: 2.3E-05oz; RoHS Compliant: Yes; Packaging: Tape and Reel; Case Code (Imperial): 0402; Military Standard: Not; Min Operating Temperature: -55°C; Depth: 0.5mm; Length: 1mm; Width: 0.02inch; Termination: SMD/SMT; Lead Free: Lead Free; Tolerance: 1%; REACH SVHC: No SVHC; Size Code: 0402; Resistance Tolerance: 1%; Series: RC; Max Operating Temperature: 155°C; Height: 0.016inch; Features: Moisture Resistant; Number of Terminations: 2; Case/Package: 0402; Resistor Type: Thick Film
R12 = CMP-2001-04378-6: RES SMD 1M OHM 1% 1/8W 0805; Temperature Coefficient: 100ppm/°C; Resistance: 1MR; Power Rating: 125mW; Voltage Rating: 150V; Length: 2mm; Height: 0.6mm; Technology: THICK FILM; Max Operating Temperature: 155°C; Case Code (Metric): 2012; Number of Terminations: 2; Radiation Hardening: No; Package Quantity: 1; Case Code (Imperial): 0805; Tolerance: 1%; RoHS Compliant: Yes; Contact Plating: Tin; Case/Package: 0805; Max Power Dissipation: 125mW; REACH SVHC: No SVHC; Lead Free: Lead Free; Termination: SMD/SMT; Size Code: 0805; Resistance Tolerance: 1%; Construction: Rectangular; Series: ERJ; Resistor Type: Thick Film; Depth: 1.25mm; Packaging: Tape and Reel; Min Operating Temperature: -55°C; Mount: Surface Mount; Features: Automotive AEC-Q200; Voltage Rating (DC): 150V; Military Standard: Not; Width: 1.2mm; Number of Pins: 2
R15 R16 = CMP-2002-01132-2: Precision Thick Film Chip Resistor, 2.2 kOhm, 100 mW, 1%, -55 to 155 degC, 2-Pin SMD (0402), RoHS, Tape and Reel; Manufacturer: Panasonic; Resistance: 2.2kO; Temp Coefficient: ±100ppm/°C; Rated Power: 0.1W; Datasheet URL: https://datasheet.ciiva.com/11821/0900766b80f80784-11821273.pdf; Tolerance (%): ±1%; Mounting Technology: SurfaceMount; Package Description: 2-Pin Surface Mount Device, Body 1 x 0.5 mm; Manufacturer URL: http://www.panasonic.com/; Datasheet Version: 03/2011; Package Reference: 0402; Size Code: 0402
SD1 = CMP-2000-05621-1: Micro SD Connector, Pitch 1.1 mm, 8 Position, Height 1.4 mm, -25 to 85 degC, RoHS, Tape and Reel; Manufacturer: Molex; Voltage Rating: 10VAC/DC; Current Rating: 500mA; Manufacturer URL: http://www.molex.com/; Package Reference: 503398-1892; Packaging: Reel; RoHS: Details; Brand: Molex; Datasheet URL: http://www.molex.com/pdm_docs/sd/5033981892_sd.pdf; Mounting Technology: SurfaceMount; Factory Pack Quantity: 2400; Datasheet Version: Rev. E, 04/2006; Series: 503398; Product Category: MemoryCardConnectors; Package Description: Micro SD Connector, Pitch 1.1 mm, 8 Position, Height 1.4 mm
U2 = CMP-79883-000001-1: IC PWR SWTCH N-CHAN 1:1 TSOT23-5; Interface: On/Off; Fault Protection: Over Temperature; Max Output Current: 1A; Number of Outputs: 1; Output Configuration: High Side; On-State Resistance: 70mR; REACH SVHC: No SVHC; Number of Pins: 23; Packaging: Tape and Reel; Case/Package: SOT-23-5; RoHS Compliant: Yes; Max Operating Temperature: 85°C; Min Operating Temperature: -40°C